# Altium project STM32F103ZET6_HARDWARE.PrjPcb
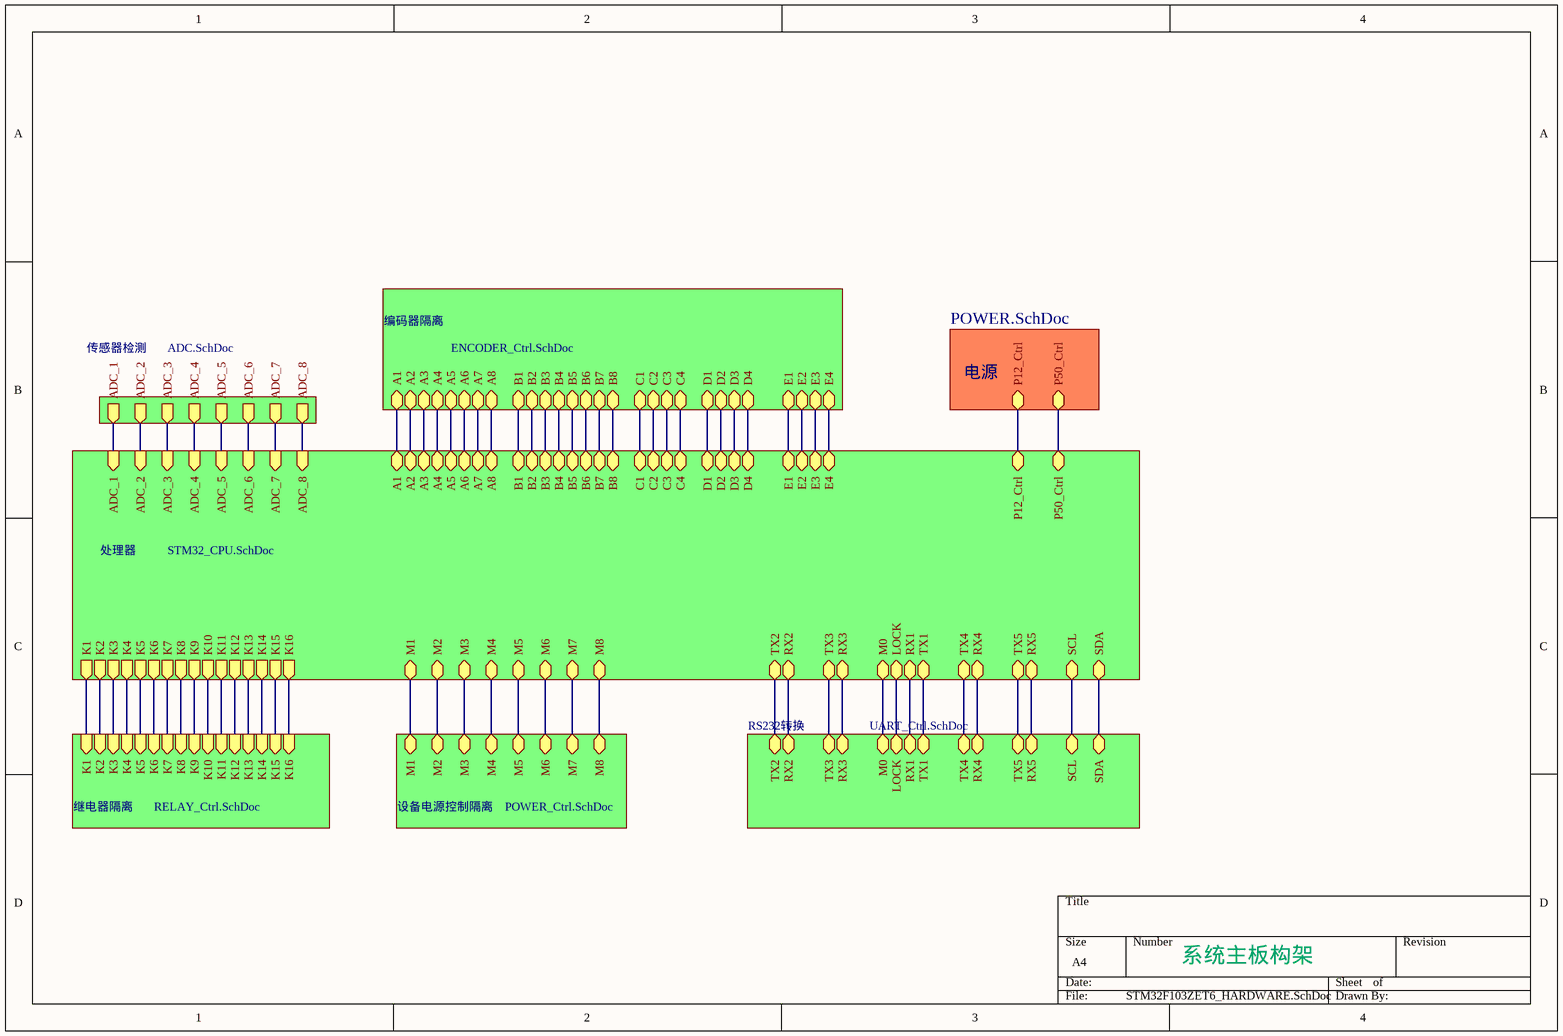
[diagram p0: STM32F103ZET6_HARDWARE.SchDoc]
8 sheets, 325 parts. Net scope: hierarchical (ports join the sheet entries above them; power ports are global).
Board file: STM32F103ZET6_HARDWARE.PcbDoc
Sheets:
  STM32F103ZET6_HARDWARE.SchDoc
    电源 = POWER.SchDoc
    处理器 = STM32_CPU.SchDoc
    编码器隔离 = ENCODER_Ctrl.SchDoc
    继电器隔离 = RELAY_Ctrl.SchDoc
    RS232转换 = UART_Ctrl.SchDoc
    设备电源控制隔离 = POWER_Ctrl.SchDoc
    传感器检测 = ADC.SchDoc

## Sheet STM32F103ZET6_HARDWARE.SchDoc: The robot embedded motherboar
size A4; CompanyName: 中煤科工集团重庆研究院; DrawnBy: leiyitan; Engineer: leiyitan@qq.com; Revision: V3.0; SheetNumber: 1; DocumentName: STM32F103ZET6_HARDWARE.SchDoc

### Sub-sheets
RS232转换 = UART_Ctrl.SchDoc: TX2, RX2, TX3, RX3, RX1, TX1, RX4 (bidir), TX4 (bidir), TX5 (bidir), RX5 (bidir), SCL (bidir), SDA (bidir), LOCK, M0
传感器检测 = ADC.SchDoc: ADC_1 (out), ADC_2 (out), ADC_3 (out), ADC_4 (out), ADC_5 (out), ADC_6 (out), ADC_7 (out), ADC_8 (out)
处理器 = STM32_CPU.SchDoc: TX1, RX1, TX2, RX2, TX3, RX3, TX4 (bidir), RX4 (bidir), M1 (bidir), M2 (bidir), M3 (bidir), M4 (bidir), M5 (bidir), M6 (bidir), M7 (bidir), M8 (bidir), K1 (out), K2 (out), K3 (out), K4 (out), K5 (out), K6 (out), A2, A4, A3, ADC_1 (in), ADC_2 (in), ADC_3 (in), ADC_4 (in), ADC_5 (in), ADC_6 (in), ADC_7 (in), ADC_8 (in), K7 (out), K8 (out), TX5 (bidir), RX5 (bidir), A1, A6, A8, A7, A5, B2 (bidir), B4 (bidir), B3 (bidir), B1 (bidir), B6 (bidir), B8 (bidir), B7 (bidir), B5 (bidir), C2 (bidir), C4 (bidir), C3 (bidir), C1 (bidir), D2 (bidir), D4 (bidir), D3 (bidir), D1 (bidir), K9 (out), K10 (out), K11 (out), K12 (out), K13 (out), K14 (out), K15 (out), K16 (out), SCL (bidir), SDA (bidir), E2 (bidir), E4 (bidir), E3 (bidir), E1 (bidir), P50_Ctrl (bidir), P12_Ctrl (bidir), LOCK, M0
电源 = POWER.SchDoc: P50_Ctrl (bidir), P12_Ctrl (bidir)
继电器隔离 = RELAY_Ctrl.SchDoc: K1 (in), K2 (in), K3 (in), K4 (in), K5 (in), K6 (in), K7 (in), K8 (in), K9 (in), K10 (in), K11 (in), K12 (in), K13 (in), K14 (in), K15 (in), K16 (in)
编码器隔离 = ENCODER_Ctrl.SchDoc: A2, A4, A3, A1, A6, A8, A7, A5, B2 (bidir), B4 (bidir), B3 (bidir), B1 (bidir), B6 (bidir), B8 (bidir), B7 (bidir), B5 (bidir), C2 (bidir), C4 (bidir), C3 (bidir), C1 (bidir), D2 (bidir), D4 (bidir), D3 (bidir), D1 (bidir), E2 (bidir), E4 (bidir), E3 (bidir), E1 (bidir)
设备电源控制隔离 = POWER_Ctrl.SchDoc: M1 (bidir), M2 (bidir), M3 (bidir), M4 (bidir), M5 (bidir), M6 (bidir), M7 (bidir), M8 (bidir)

### Nets
LOCK: sheet 处理器/LOCK, sheet RS232转换/LOCK
M0: sheet 处理器/M0, sheet RS232转换/M0
NetP2_3: sheet 处理器/ADC_4, sheet 传感器检测/ADC_4
NetP2_4: sheet 处理器/ADC_3, sheet 传感器检测/ADC_3
NetP2_5: sheet 处理器/ADC_2, sheet 传感器检测/ADC_2
NetP2_6: sheet 处理器/ADC_1, sheet 传感器检测/ADC_1
NetP25_3: sheet 处理器/TX1, sheet RS232转换/TX1
NetP25_4: sheet 处理器/RX1, sheet RS232转换/RX1
NetR2_3: sheet 处理器/ADC_8, sheet 传感器检测/ADC_8
NetR4_3: sheet 处理器/ADC_7, sheet 传感器检测/ADC_7
NetR6_3: sheet 处理器/ADC_6, sheet 传感器检测/ADC_6
NetR8_3: sheet 处理器/ADC_5, sheet 传感器检测/ADC_5
NetR14_1: sheet 处理器/C1, sheet 编码器隔离/C1
NetR17_1: sheet 处理器/C2, sheet 编码器隔离/C2
NetR18_1: sheet 处理器/A8, sheet 编码器隔离/A8
NetR19_1: sheet 处理器/C3, sheet 编码器隔离/C3
NetR22_1: sheet 处理器/A7, sheet 编码器隔离/A7
NetR23_1: sheet 处理器/C4, sheet 编码器隔离/C4
NetR24_1: sheet 处理器/A6, sheet 编码器隔离/A6
NetR27_1: sheet 处理器/A5, sheet 编码器隔离/A5
NetR30_1: sheet 处理器/A4, sheet 编码器隔离/A4
NetR33_1: sheet 处理器/D1, sheet 编码器隔离/D1
NetR34_1: sheet 处理器/A3, sheet 编码器隔离/A3
NetR35_1: sheet 处理器/A2, sheet 编码器隔离/A2
NetR37_1: sheet 处理器/D2, sheet 编码器隔离/D2
NetR39_1: sheet 处理器/D3, sheet 编码器隔离/D3
NetR40_1: sheet 处理器/A1, sheet 编码器隔离/A1
NetR43_1: sheet 处理器/D4, sheet 编码器隔离/D4
NetR47_1: sheet 处理器/B1, sheet 编码器隔离/B1
NetR48_1: sheet 处理器/E1, sheet 编码器隔离/E1
NetR50_1: sheet 处理器/B2, sheet 编码器隔离/B2
NetR52_1: sheet 处理器/E2, sheet 编码器隔离/E2
NetR53_1: sheet 处理器/B3, sheet 编码器隔离/B3
NetR55_1: sheet 处理器/E3, sheet 编码器隔离/E3
NetR57_1: sheet 处理器/B4, sheet 编码器隔离/B4
NetR58_1: sheet 处理器/E4, sheet 编码器隔离/E4
NetR62_1: sheet 处理器/B5, sheet 编码器隔离/B5
NetR64_1: sheet 处理器/B6, sheet 编码器隔离/B6
NetR65_1: sheet 处理器/B7, sheet 编码器隔离/B7
NetR67_1: sheet 处理器/B8, sheet 编码器隔离/B8
NetR118_2: sheet 处理器/SDA, sheet RS232转换/SDA
NetR119_2: sheet 处理器/SCL, sheet RS232转换/SCL
NetU13_1: sheet 电源/P12_Ctrl, sheet 处理器/P12_Ctrl
NetU13_3: sheet 电源/P50_Ctrl, sheet 处理器/P50_Ctrl
NetU14_2: sheet 处理器/M1, sheet 设备电源控制隔离/M1
NetU14_3: sheet 处理器/M2, sheet 设备电源控制隔离/M2
NetU14_4: sheet 处理器/M3, sheet 设备电源控制隔离/M3
NetU14_5: sheet 处理器/M4, sheet 设备电源控制隔离/M4
NetU14_6: sheet 处理器/M5, sheet 设备电源控制隔离/M5
NetU14_7: sheet 处理器/M6, sheet 设备电源控制隔离/M6
NetU14_8: sheet 处理器/M7, sheet 设备电源控制隔离/M7
NetU14_9: sheet 处理器/M8, sheet 设备电源控制隔离/M8
NetU16_36: sheet 处理器/TX2, sheet RS232转换/TX2
NetU16_37: sheet 处理器/RX2, sheet RS232转换/RX2
NetU16_49: sheet 处理器/K16, sheet 继电器隔离/K16
NetU16_50: sheet 处理器/K15, sheet 继电器隔离/K15
NetU16_53: sheet 处理器/K14, sheet 继电器隔离/K14
NetU16_54: sheet 处理器/K13, sheet 继电器隔离/K13
NetU16_55: sheet 处理器/K12, sheet 继电器隔离/K12
NetU16_56: sheet 处理器/K11, sheet 继电器隔离/K11
NetU16_57: sheet 处理器/K10, sheet 继电器隔离/K10
NetU16_58: sheet 处理器/K9, sheet 继电器隔离/K9
NetU16_59: sheet 处理器/K8, sheet 继电器隔离/K8
NetU16_60: sheet 处理器/K7, sheet 继电器隔离/K7
NetU16_63: sheet 处理器/K6, sheet 继电器隔离/K6
NetU16_64: sheet 处理器/K5, sheet 继电器隔离/K5
NetU16_65: sheet 处理器/K4, sheet 继电器隔离/K4
NetU16_66: sheet 处理器/K3, sheet 继电器隔离/K3
NetU16_67: sheet 处理器/K2, sheet 继电器隔离/K2
NetU16_68: sheet 处理器/K1, sheet 继电器隔离/K1
NetU16_69: sheet 处理器/TX3, sheet RS232转换/TX3
NetU16_70: sheet 处理器/RX3, sheet RS232转换/RX3
NetU16_111: sheet 处理器/TX4, sheet RS232转换/TX4
NetU16_112: sheet 处理器/RX4, sheet RS232转换/RX4
NetU16_113: sheet 处理器/TX5, sheet RS232转换/TX5
NetU16_116: sheet 处理器/RX5, sheet RS232转换/RX5

### Notes on the sheet
- 系统主板构架

## Sheet POWER.SchDoc
size A4
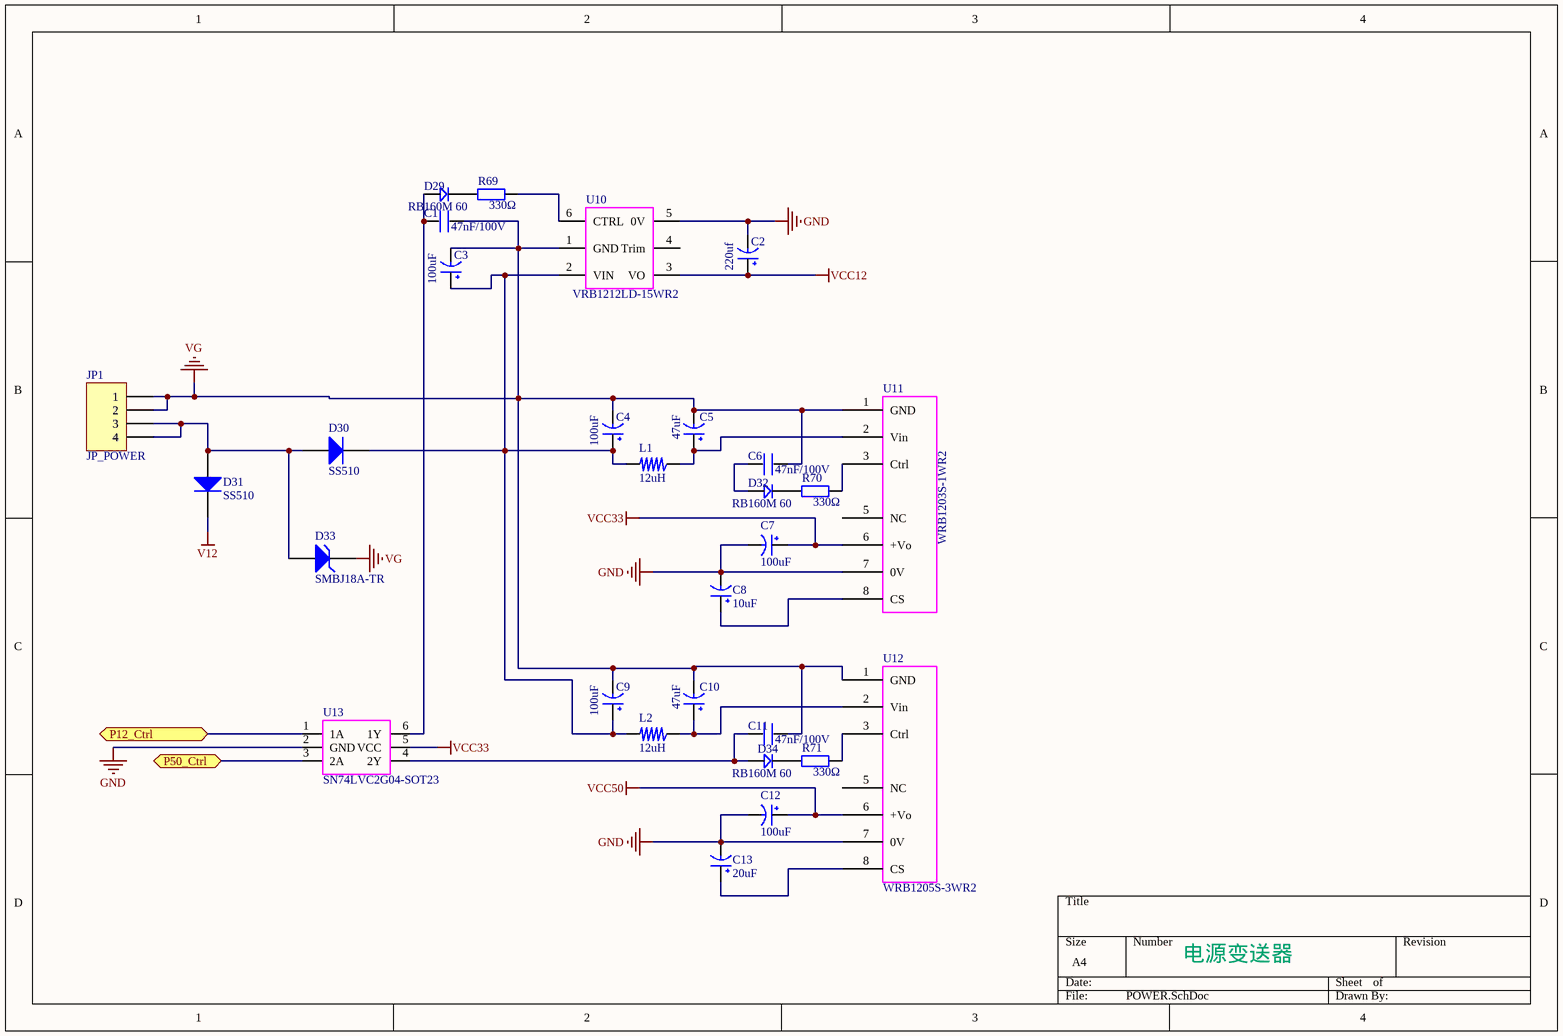
[diagram p1: POWER.SchDoc]

### Parts
C1  47nF/100V  [0603P]
C2  220uf  [SMD-EC-F6.3]
C3  100uF  [SMD-EC-F6.3]
C4  100uF  [SMD-EC-F6.3]
C5  47uF  [SMD-EC-F6.3]
C6  47nF/100V  [0603P]
C7  100uF  [SMD-EC-F6.3]
C8  10uF  [SMD-EC-F4]
C9  100uF  [SMD-EC-F6.3]
C10  47uF  [SMD-EC-F6.3]
C11  47nF/100V  [0603P]
C12  100uF  [SMD-EC-F6.3]
C13  20uF  [SMD-EC-F4]
D29  RB160M 60  [SOD123/X.85]
D30  SS510  [SMC]
D31  SS510  [SMC]
D32  RB160M 60  [SOD123/X.85]
D33  SMBJ18A-TR  [DO-214]
D34  RB160M 60  [SOD123/X.85]
JP1  JP_POWER  [3.81-4P]
L1  12uH  [4R7_L_7_7_4]
L2  12uH  [4R7_L_7_7_4]
R69  value 330Ω  [1206]  (hidden comment: Res2)
R70  value 330Ω  [1206]  (hidden comment: Res2)
R71  value 330Ω  [1206]  (hidden comment: Res2)
U10  VRB1212LD-15WR2  [VRB1212LD-15WR2]
U11  WRB1203S-1WR2  [WRB120XS-XWR2]
U12  WRB1205S-3WR2  [WRB120XS-XWR2]
U13  SN74LVC2G04-SOT23  [SOT23-6]

### Ports
P12_Ctrl, P50_Ctrl

### Nets
GND: C2.2(GND) C7.2(GND) C8.2(GND) C12.2(GND) C13.2(GND) U10.5(0V) U11.7(0V) U12.7(0V) U13.2(GND)
V12: D31.2(K)
VCC12: C2.1(VCC) U10.3(VO)
VCC33: C7.1(VCC) U11.6(+Vo) U13.5(VCC)
VCC50: C12.1(VCC) U12.6(+Vo)
VG: C1.2 C3.2(GND) C4.2(GND) C5.2(GND) C6.2 C9.2(GND) C10.2(GND) C11.2 D33.2(K) JP1.1 JP1.2 U10.1(GND) U11.1(GND) U12.1(GND)
NetC1_1: C1.1 D29.1 U13.6(1Y)
NetC3_1: C3.1(VCC) C4.1(VCC) C9.1(VCC) D30.2(K) L1.2 L2.2 U10.2(VIN)
NetC5_1: C5.1(VCC) L1.1 U11.2(Vin)
NetC6_1: C6.1 D32.1
NetC8_1: C8.1(VCC) U11.8(CS)
NetC10_1: C10.1(VCC) L2.1 U12.2(Vin)
NetC11_1: C11.1 D34.1 U13.4(2Y)
NetC13_1: C13.1(VCC) U12.8(CS)
NetD29_2: D29.2 R69.2
NetD30_1: D30.1(A) D31.1(A) D33.1(A) JP1.3 JP1.4
NetD32_2: D32.2 R70.2
NetD34_2: D34.2 R71.2
NetR69_1: R69.1 U10.6(CTRL)
NetR70_1: R70.1 U11.3(Ctrl)
NetR71_1: R71.1 U12.3(Ctrl)
NetU13_1: U13.1(1A) ; port P12_Ctrl
NetU13_3: U13.3(2A) ; port P50_Ctrl

Not connected (* = marked no-connect by the designer): U10 4(Trim); U11 5(NC); U12 5(NC)

### Notes on the sheet
- 电源变送器

### Library data of the parts
C1 C6 C11 = C
C2-C5 C7-C10 C12 C13 = CAP
D29 D32 D34 = D
D30 D31 = Diode: Default Diode; Published: 8-Jun-2000; LatestRevisionDate: 17-Jul-2002; LatestRevisionNote: Re-released for DXP Platform.; PackageVersion: Sep-1996; PackageReference: SMC; Publisher: Altium Limited; Code_JEDEC: DO-214-AB
D33 = D Zener: Zener Diode; Published: 8-Jun-2000; LatestRevisionDate: 17-Jul-2002; LatestRevisionNote: Re-released for DXP Platform.; PackageReference: DIODE-0.7; Publisher: Altium Limited
JP1 = Header 4: Header, 4-Pin; LatestRevisionDate: 17-Jul-2002; LatestRevisionNote: Re-released for DXP Platform.; Publisher: Altium Limited
L1 L2 = L_SOP
R69-R71 = Res2: Resistor; Published: 8-Jun-2000; LatestRevisionDate: 17-Jul-2002; LatestRevisionNote: Re-released for DXP Platform.; PackageReference: AXIAL-0.4; Publisher: Altium Limited

## Sheet STM32_CPU.SchDoc
size A3
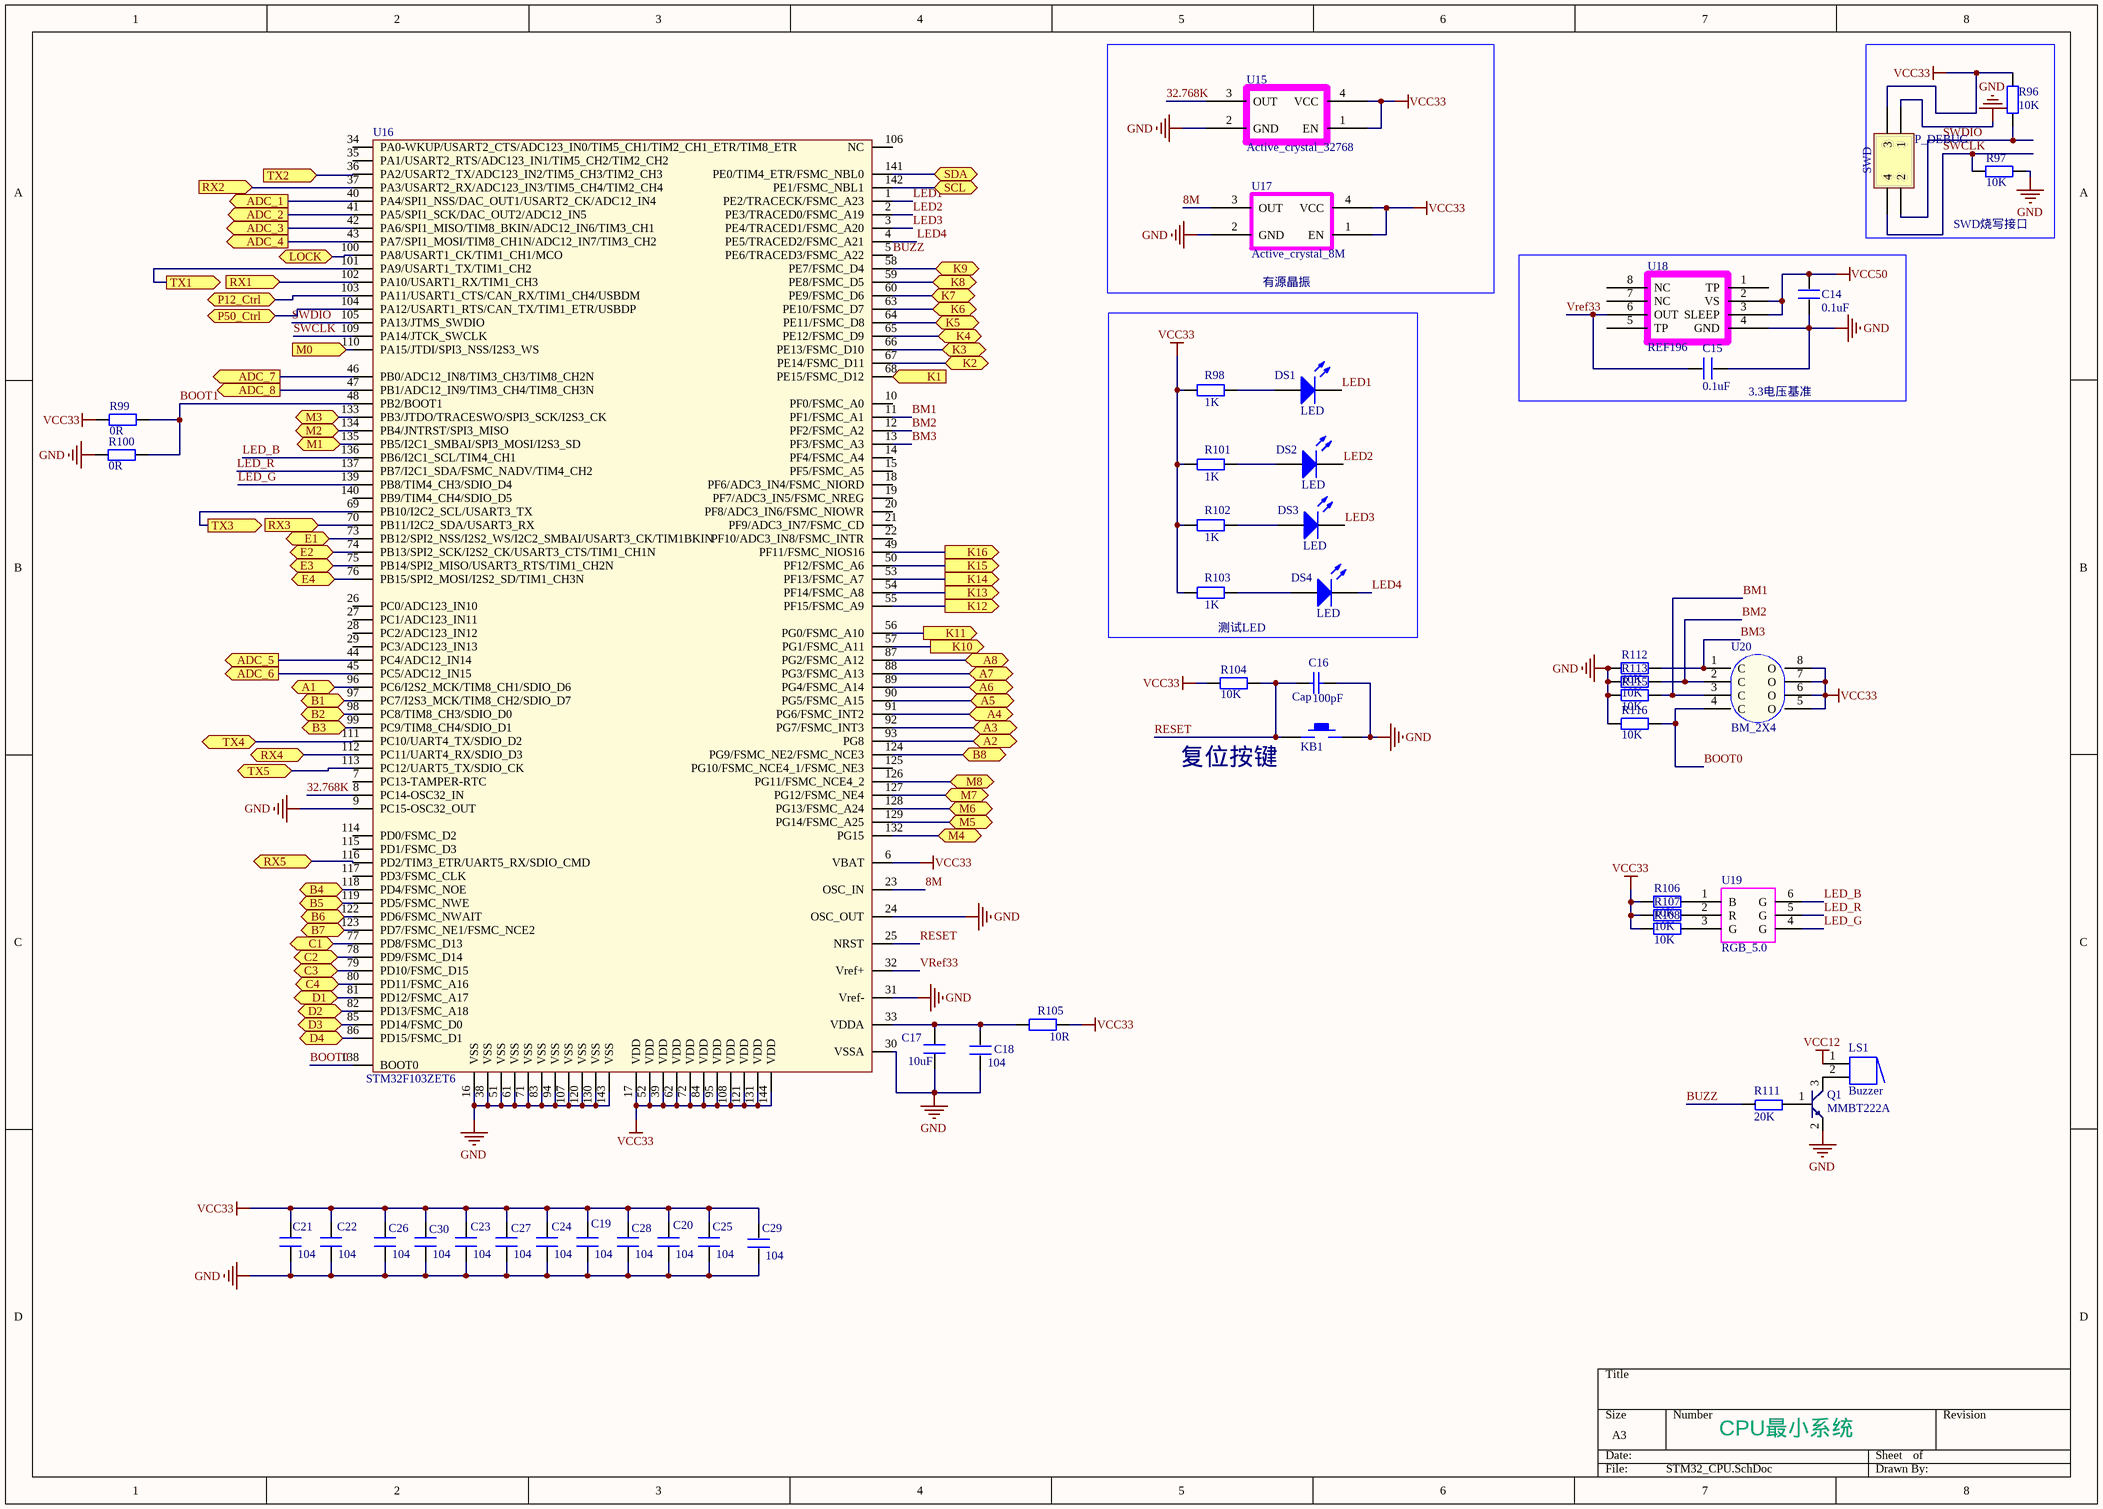
[diagram p2: STM32_CPU.SchDoc]

### Parts
C14  0.1uF  [CAPC1608L]
C15  0.1uF  [CAPC1608L]
C16  Cap  value 100pF  [1206C]
C17  10uF  [1206]
C18  104  [1206]
C19  104  [1206]
C20  104  [1206]
C21  104  [1206]
C22  104  [1206]
C23  104  [1206]
C24  104  [1206]
C25  104  [1206]
C26  104  [1206]
C27  104  [1206]
C28  104  [1206]
C29  104  [1206]
C30  104  [1206]
DS1  LED  [LED-1206]
DS2  LED  [LED-1206]
DS3  LED  [LED-1206]
DS4  LED  [LED-1206]
KB1  KEY_M  [HDR1X2]  (value not drawn)
LS1  Buzzer  [BELL]
P_DEBUG  SWD  [HDR2X2]
Q1  MMBT222A  [SOT-23]
R96  value 10K  [1206]  (hidden comment: Res2)
R97  value 10K  [1206]  (hidden comment: Res2)
R98  value 1K  [1206R]  (hidden comment: Res2)
R99  value 0R  [1206R]  (hidden comment: Res2)
R100  value 0R  [1206R]  (hidden comment: Res2)
R101  value 1K  [1206R]  (hidden comment: Res2)
R102  value 1K  [1206R]  (hidden comment: Res2)
R103  value 1K  [1206R]  (hidden comment: Res2)
R104  value 10K  [1206R]  (hidden comment: Res2)
R105  value 10R  [1206]  (hidden comment: Res2)
R106  value 10K  [1206]  (hidden comment: Res2)
R107  value 10K  [1206]  (hidden comment: Res2)
R108  value 10K  [1206]  (hidden comment: Res2)
R111  20K  [1206R]
R112  value 10K  [1206]  (hidden comment: Res2)
R113  value 10K  [1206]  (hidden comment: Res2)
R115  value 10K  [1206]  (hidden comment: Res2)
R116  value 10K  [1206]  (hidden comment: Res2)
U15  Active_crystal_32768  [Active_crystal_3225]
U16  STM32F103ZET6  [LQFP144]
U17  Active_crystal_8M  [Active_crystal_3225]
U18  REF196  [SOP8N]
U19  RGB_5.0  [RGB_5.0]
U20  BM_2X4  [BM_2X4]

### Blocks framed on the sheet
有源晶振: U15 U17
SWD烧写接口: P_DEBUG R96 R97
3.3电压基准: C14 C15 U18
测试LED: DS1-DS4 R98 R101-R103

### Ports
A1, A2, A3, A4, A5, A6, A7, A8, ADC_1 (out), ADC_2 (out), ADC_3 (out), ADC_4 (out), ADC_5 (out), ADC_6 (out), ADC_7 (out), ADC_8 (out), B1, B2, B3, B4, B5, B6, B7, B8, C1, C2, C3, C4, D1, D2, D3, D4, E1, E2, E3, E4, K1 (out), K2, K3, K4, K5, K6, K7, K8, K9, K10 (out), K11 (out), K12 (out), K13 (out), K14 (out), K15 (out), K16 (out), LOCK, M0 (in), M1, M2, M3, M4, M5, M6, M7, M8, P12_Ctrl, P50_Ctrl, RX1 (in), RX2, RX3 (in), RX4 (bidir), RX5, SCL (bidir), SDA (bidir), TX1 (out), TX2, TX3 (out), TX4 (bidir), TX5

### Nets
GND: C14.1 C15.2 C16.1 C17.2 C18.2 C19.2 C20.2 C21.2 C22.2 C23.2 C24.2 C25.2 C26.2 C27.2 C28.2 C29.2 C30.2 KB1.2 P_DEBUG.1 Q1.2(E) R97.2 R100.2 R112.1 R113.1 R115.1 R116.1 U15.2(GND) U16.9(PC15-OSC32_OUT) U16.16(VSS) U16.24(OSC_OUT) U16.30(VSSA) U16.31(Vref-) U16.38(VSS) U16.51(VSS) U16.61(VSS) U16.71(VSS) U16.83(VSS) U16.94(VSS) U16.107(VSS) U16.120(VSS) U16.130(VSS) U16.143(VSS) U17.2(GND) U18.4(GND)
VCC12: LS1.1
VCC33: C19.1 C20.1 C21.1 C22.1 C23.1 C24.1 C25.1 C26.1 C27.1 C28.1 C29.1 C30.1 P_DEBUG.3 R96.2 R98.1 R99.2 R101.1 R102.1 R103.1 R104.2 R105.1 R106.2 R107.2 R108.2 U15.1(EN) U15.4(VCC) U16.6(VBAT) U16.17(VDD) U16.39(VDD) U16.52(VDD) U16.62(VDD) U16.72(VDD) U16.84(VDD) U16.95(VDD) U16.108(VDD) U16.121(VDD) U16.131(VDD) U16.144(VDD) U17.1(EN) U17.4(VCC) U20.5(O) U20.6(O) U20.7(O) U20.8(O)
VCC50: C14.2 U18.2(VS) U18.3(SLEEP)
8M: U16.23(OSC_IN) U17.3(OUT)
32.768K: U15.3(OUT) U16.8(PC14-OSC32_IN)
BM1: R115.2 U16.11(PF1/FSMC_A1) U20.3(C)
BM2: R113.2 U16.12(PF2/FSMC_A2) U20.2(C)
BM3: R112.2 U16.13(PF3/FSMC_A3) U20.1(C)
BOOT0: R116.2 U16.138(BOOT0) U20.4(C)
BOOT1: R99.1 R100.1 U16.48(PB2/BOOT1)
BUZZ: R111.1 U16.5(PE6/TRACED3/FSMC_A22)
LED1: DS1.2(K) U16.1(PE2/TRACECK/FSMC_A23)
LED2: DS2.2(K) U16.2(PE3/TRACED0/FSMC_A19)
LED3: DS3.2(K) U16.3(PE4/TRACED1/FSMC_A20)
LED4: DS4.2(K) U16.4(PE5/TRACED2/FSMC_A21)
LED_B: U16.136(PB6/I2C1_SCL/TIM4_CH1) U19.6(G)
LED_G: U16.139(PB8/TIM4_CH3/SDIO_D4) U19.4(G)
LED_R: U16.137(PB7/I2C1_SDA/FSMC_NADV/TIM4_CH2) U19.5(G)
LOCK: U16.100(PA8/USART1_CK/TIM1_CH1/MCO) ; port LOCK
M0: U16.110(PA15/JTDI/SPI3_NSS/I2S3_WS) ; port M0
RESET: C16.2 KB1.1 R104.1 U16.25(NRST)
SWCLK: P_DEBUG.4 R97.1 U16.109(PA14/JTCK_SWCLK)
SWDIO: P_DEBUG.2 R96.1 U16.105(PA13/JTMS_SWDIO)
Vref33: C15.1 U16.32(Vref+) U18.6(OUT)
NetC17_1: C17.1 C18.1 R105.2 U16.33(VDDA)
NetDS1_1: DS1.1(A) R98.2
NetDS2_1: DS2.1(A) R101.2
NetDS3_1: DS3.1(A) R102.2
NetDS4_1: DS4.1(A) R103.2
NetLS1_2: LS1.2 Q1.3(C)
NetP2_3: U16.43(PA7/SPI1_MOSI/TIM8_CH1N/ADC12_IN7/TIM3_CH2) ; port ADC_4
NetP2_4: U16.42(PA6/SPI1_MISO/TIM8_BKIN/ADC12_IN6/TIM3_CH1) ; port ADC_3
NetP2_5: U16.41(PA5/SPI1_SCK/DAC_OUT2/ADC12_IN5) ; port ADC_2
NetP2_6: U16.40(PA4/SPI1_NSS/DAC_OUT1/USART2_CK/ADC12_IN4) ; port ADC_1
NetP25_3: U16.101(PA9/USART1_TX/TIM1_CH2) ; port TX1
NetP25_4: U16.102(PA10/USART1_RX/TIM1_CH3) ; port RX1
NetQ1_1: Q1.1(B) R111.2
NetR2_3: U16.47(PB1/ADC12_IN9/TIM3_CH4/TIM8_CH3N) ; port ADC_8
NetR4_3: U16.46(PB0/ADC12_IN8/TIM3_CH3/TIM8_CH2N) ; port ADC_7
NetR6_3: U16.45(PC5/ADC12_IN15) ; port ADC_6
NetR8_3: U16.44(PC4/ADC12_IN14) ; port ADC_5
NetR14_1: U16.77(PD8/FSMC_D13) ; port C1
NetR17_1: U16.78(PD9/FSMC_D14) ; port C2
NetR18_1: U16.87(PG2/FSMC_A12) ; port A8
NetR19_1: U16.79(PD10/FSMC_D15) ; port C3
NetR22_1: U16.88(PG3/FSMC_A13) ; port A7
NetR23_1: U16.80(PD11/FSMC_A16) ; port C4
NetR24_1: U16.89(PG4/FSMC_A14) ; port A6
NetR27_1: U16.90(PG5/FSMC_A15) ; port A5
NetR30_1: U16.91(PG6/FSMC_INT2) ; port A4
NetR33_1: U16.81(PD12/FSMC_A17) ; port D1
NetR34_1: U16.92(PG7/FSMC_INT3) ; port A3
NetR35_1: U16.93(PG8) ; port A2
NetR37_1: U16.82(PD13/FSMC_A18) ; port D2
NetR39_1: U16.85(PD14/FSMC_D0) ; port D3
NetR40_1: U16.96(PC6/I2S2_MCK/TIM8_CH1/SDIO_D6) ; port A1
NetR43_1: U16.86(PD15/FSMC_D1) ; port D4
NetR47_1: U16.97(PC7/I2S3_MCK/TIM8_CH2/SDIO_D7) ; port B1
NetR48_1: U16.73(PB12/SPI2_NSS/I2S2_WS/I2C2_SMBAI/USART3_CK/TIM1BKIN) ; port E1
NetR50_1: U16.98(PC8/TIM8_CH3/SDIO_D0) ; port B2
NetR52_1: U16.74(PB13/SPI2_SCK/I2S2_CK/USART3_CTS/TIM1_CH1N) ; port E2
NetR53_1: U16.99(PC9/TIM8_CH4/SDIO_D1) ; port B3
NetR55_1: U16.75(PB14/SPI2_MISO/USART3_RTS/TIM1_CH2N) ; port E3
NetR57_1: U16.118(PD4/FSMC_NOE) ; port B4
NetR58_1: U16.76(PB15/SPI2_MOSI/I2S2_SD/TIM1_CH3N) ; port E4
NetR62_1: U16.119(PD5/FSMC_NWE) ; port B5
NetR64_1: U16.122(PD6/FSMC_NWAIT) ; port B6
NetR65_1: U16.123(PD7/FSMC_NE1/FSMC_NCE2) ; port B7
NetR67_1: U16.124(PG9/FSMC_NE2/FSMC_NCE3) ; port B8
NetR106_1: R106.1 U19.1(B)
NetR107_1: R107.1 U19.2(R)
NetR108_1: R108.1 U19.3(G)
NetR118_2: U16.141(PE0/TIM4_ETR/FSMC_NBL0) ; port SDA
NetR119_2: U16.142(PE1/FSMC_NBL1) ; port SCL
NetU13_1: U16.103(PA11/USART1_CTS/CAN_RX/TIM1_CH4/USBDM) ; port P12_Ctrl
NetU13_3: U16.104(PA12/USART1_RTS/CAN_TX/TIM1_ETR/USBDP) ; port P50_Ctrl
NetU14_2: U16.135(PB5/I2C1_SMBAI/SPI3_MOSI/I2S3_SD) ; port M1
NetU14_3: U16.134(PB4/JNTRST/SPI3_MISO) ; port M2
NetU14_4: U16.133(PB3/JTDO/TRACESWO/SPI3_SCK/I2S3_CK) ; port M3
NetU14_5: U16.132(PG15) ; port M4
NetU14_6: U16.129(PG14/FSMC_A25) ; port M5
NetU14_7: U16.128(PG13/FSMC_A24) ; port M6
NetU14_8: U16.127(PG12/FSMC_NE4) ; port M7
NetU14_9: U16.126(PG11/FSMC_NCE4_2) ; port M8
NetU16_36: U16.36(PA2/USART2_TX/ADC123_IN2/TIM5_CH3/TIM2_CH3) ; port TX2
NetU16_37: U16.37(PA3/USART2_RX/ADC123_IN3/TIM5_CH4/TIM2_CH4) ; port RX2
NetU16_49: U16.49(PF11/FSMC_NIOS16) ; port K16
NetU16_50: U16.50(PF12/FSMC_A6) ; port K15
NetU16_53: U16.53(PF13/FSMC_A7) ; port K14
NetU16_54: U16.54(PF14/FSMC_A8) ; port K13
NetU16_55: U16.55(PF15/FSMC_A9) ; port K12
NetU16_56: U16.56(PG0/FSMC_A10) ; port K11
NetU16_57: U16.57(PG1/FSMC_A11) ; port K10
NetU16_58: U16.58(PE7/FSMC_D4) ; port K9
NetU16_59: U16.59(PE8/FSMC_D5) ; port K8
NetU16_60: U16.60(PE9/FSMC_D6) ; port K7
NetU16_63: U16.63(PE10/FSMC_D7) ; port K6
NetU16_64: U16.64(PE11/FSMC_D8) ; port K5
NetU16_65: U16.65(PE12/FSMC_D9) ; port K4
NetU16_66: U16.66(PE13/FSMC_D10) ; port K3
NetU16_67: U16.67(PE14/FSMC_D11) ; port K2
NetU16_68: U16.68(PE15/FSMC_D12) ; port K1
NetU16_69: U16.69(PB10/I2C2_SCL/USART3_TX) ; port TX3
NetU16_70: U16.70(PB11/I2C2_SDA/USART3_RX) ; port RX3
NetU16_111: U16.111(PC10/UART4_TX/SDIO_D2) ; port TX4
NetU16_112: U16.112(PC11/UART4_RX/SDIO_D3) ; port RX4
NetU16_113: U16.113(PC12/UART5_TX/SDIO_CK) ; port TX5
NetU16_116: U16.116(PD2/TIM3_ETR/UART5_RX/SDIO_CMD) ; port RX5

Not connected (* = marked no-connect by the designer): U16 7(PC13-TAMPER-RTC) 10(PF0/FSMC_A0) 14(PF4/FSMC_A4) 15(PF5/FSMC_A5) 18(PF6/ADC3_IN4/FSMC_NIORD) 19(PF7/ADC3_IN5/FSMC_NREG) 20(PF8/ADC3_IN6/FSMC_NIOWR) 21(PF9/ADC3_IN7/FSMC_CD) 22(PF10/ADC3_IN8/FSMC_INTR) 26(PC0/ADC123_IN10) 27(PC1/ADC123_IN11) 28(PC2/ADC123_IN12) 29(PC3/ADC123_IN13) 34(PA0-WKUP/USART2_CTS/ADC123_IN0/TIM5_CH1/TIM2_CH1_ETR/TIM8_ETR) 35(PA1/USART2_RTS/ADC123_IN1/TIM5_CH2/TIM2_CH2) 106(NC) 114(PD0/FSMC_D2) 115(PD1/FSMC_D3) 117(PD3/FSMC_CLK) 125(PG10/FSMC_NCE4_1/FSMC_NE3) 140(PB9/TIM4_CH4/SDIO_D5); U18 1(TP) 5(TP) 7(NC) 8(NC)

### Notes on the sheet
- 复位按键
- CPU最小系统

### Library data of the parts
C14 C15 C17-C30 = C
C16 = Cap: Capacitor; Published: 8-Jun-2000; LatestRevisionDate: 17-Jul-2002; LatestRevisionNote: Re-released for DXP Platform.; PackageReference: RAD-0.3; Publisher: Altium Limited
DS1-DS4 = LED2: Typical RED, GREEN, YELLOW, AMBER GaAs LED; Published: 8-Jun-2000; LatestRevisionDate: 17-Jul-2002; LatestRevisionNote: Re-released for DXP Platform.; PackageDocument: Feb-2002; PackageReference: 3.2X1.6X1.1; Publisher: Altium Limited
LS1 = Buzzer: Magnetic Transducer Buzzer; Published: 24-Mar-1999; LatestRevisionDate: 17-Dec-2003; LatestRevisionNote: Schematic revised, PCB Footprint replaced.; DatasheetVersion: 17-Dec-2003; PackageReference: ABSM-1574; Publisher: Altium Limited; ComponentLink1Description: Manufacturer Link; ComponentLink1URL: http://www.megastar.com/linecard/buzzmode/index.php
P_DEBUG = Header 2X2: Header, 2-Pin, Dual row; LatestRevisionDate: 17-Jul-2002; LatestRevisionNote: Re-released for DXP Platform.; Publisher: Altium Limited
Q1 = NPN: 8050/BCW846/BCW847
R96-R108 R112 R113 R115 R116 = Res2: Resistor; Published: 8-Jun-2000; LatestRevisionDate: 17-Jul-2002; LatestRevisionNote: Re-released for DXP Platform.; PackageReference: AXIAL-0.4; Publisher: Altium Limited
R111 = R

## Sheet ENCODER_Ctrl.SchDoc
size A4
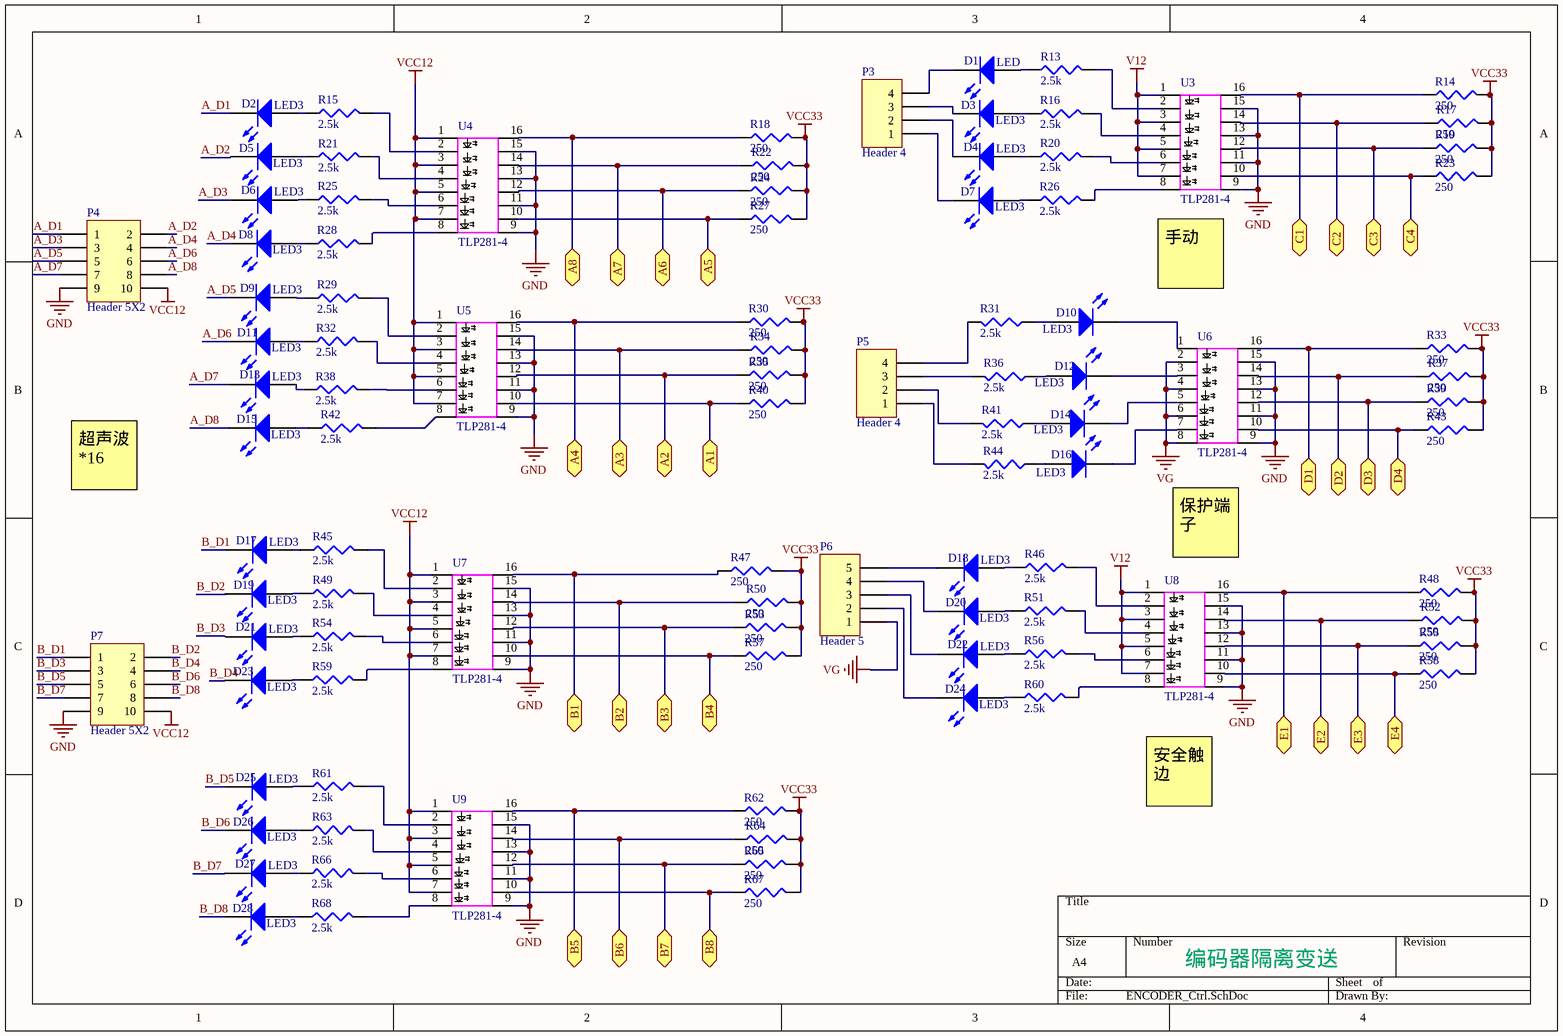
[diagram p3: ENCODER_Ctrl.SchDoc]

### Parts
D1  LED  [LED-1206]
D2  LED3  [LED-1206]
D3  LED3  [LED-1206]
D4  LED3  [LED-1206]
D5  LED3  [LED-1206]
D6  LED3  [LED-1206]
D7  LED3  [LED-1206]
D8  LED3  [LED-1206]
D9  LED3  [LED-1206]
D10  LED3  [LED-1206]
D11  LED3  [LED-1206]
D12  LED3  [LED-1206]
D13  LED3  [LED-1206]
D14  LED3  [LED-1206]
D15  LED3  [LED-1206]
D16  LED3  [LED-1206]
D17  LED3  [LED-1206]
D18  LED3  [LED-1206]
D19  LED3  [LED-1206]
D20  LED3  [LED-1206]
D21  LED3  [LED-1206]
D22  LED3  [LED-1206]
D23  LED3  [LED-1206]
D24  LED3  [LED-1206]
D25  LED3  [LED-1206]
D26  LED3  [LED-1206]
D27  LED3  [LED-1206]
D28  LED3  [LED-1206]
P3  Header 4  [3.81-4P]
P4  Header 5X2  [HDR2X5]
P5  Header 4  [3.81-4P]
P6  Header 5  [3.81-5P]
P7  Header 5X2  [HDR2X5]
R13  value 2.5k  [1206R]  (hidden comment: Res3)
R14  value 250  [1206R]  (hidden comment: Res3)
R15  value 2.5k  [1206R]  (hidden comment: Res3)
R16  value 2.5k  [1206R]  (hidden comment: Res3)
R17  value 250  [1206R]  (hidden comment: Res3)
R18  value 250  [1206R]  (hidden comment: Res3)
R19  value 250  [1206R]  (hidden comment: Res3)
R20  value 2.5k  [1206R]  (hidden comment: Res3)
R21  value 2.5k  [1206R]  (hidden comment: Res3)
R22  value 250  [1206R]  (hidden comment: Res3)
R23  value 250  [1206R]  (hidden comment: Res3)
R24  value 250  [1206R]  (hidden comment: Res3)
R25  value 2.5k  [1206R]  (hidden comment: Res3)
R26  value 2.5k  [1206R]  (hidden comment: Res3)
R27  value 250  [1206R]  (hidden comment: Res3)
R28  value 2.5k  [1206R]  (hidden comment: Res3)
R29  value 2.5k  [1206R]  (hidden comment: Res3)
R30  value 250  [1206R]  (hidden comment: Res3)
R31  value 2.5k  [1206R]  (hidden comment: Res3)
R32  value 2.5k  [1206R]  (hidden comment: Res3)
R33  value 250  [1206R]  (hidden comment: Res3)
R34  value 250  [1206R]  (hidden comment: Res3)
R35  value 250  [1206R]  (hidden comment: Res3)
R36  value 2.5k  [1206R]  (hidden comment: Res3)
R37  value 250  [1206R]  (hidden comment: Res3)
R38  value 2.5k  [1206R]  (hidden comment: Res3)
R39  value 250  [1206R]  (hidden comment: Res3)
R40  value 250  [1206R]  (hidden comment: Res3)
R41  value 2.5k  [1206R]  (hidden comment: Res3)
R42  value 2.5k  [1206R]  (hidden comment: Res3)
R43  value 250  [1206R]  (hidden comment: Res3)
R44  value 2.5k  [1206R]  (hidden comment: Res3)
R45  value 2.5k  [1206R]  (hidden comment: Res3)
R46  value 2.5k  [1206R]  (hidden comment: Res3)
R47  value 250  [1206R]  (hidden comment: Res3)
R48  value 250  [1206R]  (hidden comment: Res3)
R49  value 2.5k  [1206R]  (hidden comment: Res3)
R50  value 250  [1206R]  (hidden comment: Res3)
R51  value 2.5k  [1206R]  (hidden comment: Res3)
R52  value 250  [1206R]  (hidden comment: Res3)
R53  value 250  [1206R]  (hidden comment: Res3)
R54  value 2.5k  [1206R]  (hidden comment: Res3)
R55  value 250  [1206R]  (hidden comment: Res3)
R56  value 2.5k  [1206R]  (hidden comment: Res3)
R57  value 250  [1206R]  (hidden comment: Res3)
R58  value 250  [1206R]  (hidden comment: Res3)
R59  value 2.5k  [1206R]  (hidden comment: Res3)
R60  value 2.5k  [1206R]  (hidden comment: Res3)
R61  value 2.5k  [1206R]  (hidden comment: Res3)
R62  value 250  [1206R]  (hidden comment: Res3)
R63  value 2.5k  [1206R]  (hidden comment: Res3)
R64  value 250  [1206R]  (hidden comment: Res3)
R65  value 250  [1206R]  (hidden comment: Res3)
R66  value 2.5k  [1206R]  (hidden comment: Res3)
R67  value 250  [1206R]  (hidden comment: Res3)
R68  value 2.5k  [1206R]  (hidden comment: Res3)
U3  TLP281-4  [SO16]
U4  TLP281-4  [SO16]
U5  TLP281-4  [SO16]
U6  TLP281-4  [SO16]
U7  TLP281-4  [SO16]
U8  TLP281-4  [SO16]
U9  TLP281-4  [SO16]

### Ports
A1, A2, A3, A4, A5, A6, A7, A8, B1, B2, B3, B4, B5, B6, B7, B8, C1, C2, C3, C4, D1, D2, D3, D4, E1, E2, E3, E4

### Nets
GND: P4.9 P7.9 U3.9 U3.11 U3.13 U3.15 U4.9 U4.11 U4.13 U4.15 U5.9 U5.11 U5.13 U5.15 U6.9 U6.11 U6.13 U6.15 U7.9 U7.11 U7.13 U7.15 U8.9 U8.11 U8.13 U8.15 U9.9 U9.11 U9.13 U9.15
V12: U3.1 U3.3 U3.5 U3.7 U8.1 U8.3 U8.5 U8.7
VCC12: P4.10 P7.10 U4.1 U4.3 U4.5 U4.7 U5.1 U5.3 U5.5 U5.7 U7.1 U7.3 U7.5 U7.7 U9.1 U9.3 U9.5 U9.7
VCC33: R14.2 R17.2 R18.2 R19.2 R22.2 R23.2 R24.2 R27.2 R30.2 R33.2 R34.2 R35.2 R37.2 R39.2 R40.2 R43.2 R47.2 R48.2 R50.2 R52.2 R53.2 R55.2 R57.2 R58.2 R62.2 R64.2 R65.2 R67.2
VG: P6.1 U6.2 U6.4 U6.6 U6.8
A_D1: D2.2(K) P4.1
A_D2: D5.2(K) P4.2
A_D3: D6.2(K) P4.3
A_D4: D8.2(K) P4.4
A_D5: D9.2(K) P4.5
A_D6: D11.2(K) P4.6
A_D7: D13.2(K) P4.7
A_D8: D15.2(K) P4.8
B_D1: D17.2(K) P7.1
B_D2: D19.2(K) P7.2
B_D3: D21.2(K) P7.3
B_D4: D23.2(K) P7.4
B_D5: D25.2(K) P7.5
B_D6: D26.2(K) P7.6
B_D7: D27.2(K) P7.7
B_D8: D28.2(K) P7.8
NetD1_1: D1.1(A) R13.1
NetD1_2: D1.2(K) P3.4
NetD2_1: D2.1(A) R15.1
NetD3_1: D3.1(A) R16.1
NetD3_2: D3.2(K) P3.3
NetD4_1: D4.1(A) R20.1
NetD4_2: D4.2(K) P3.2
NetD5_1: D5.1(A) R21.1
NetD6_1: D6.1(A) R25.1
NetD7_1: D7.1(A) R26.1
NetD7_2: D7.2(K) P3.1
NetD8_1: D8.1(A) R28.1
NetD9_1: D9.1(A) R29.1
NetD10_1: D10.1(A) R31.1
NetD10_2: D10.2(K) U6.1
NetD11_1: D11.1(A) R32.1
NetD12_1: D12.1(A) R36.1
NetD12_2: D12.2(K) U6.3
NetD13_1: D13.1(A) R38.1
NetD14_1: D14.1(A) R41.1
NetD14_2: D14.2(K) U6.5
NetD15_1: D15.1(A) R42.1
NetD16_1: D16.1(A) R44.1
NetD16_2: D16.2(K) U6.7
NetD17_1: D17.1(A) R45.1
NetD18_1: D18.1(A) R46.1
NetD18_2: D18.2(K) P6.5
NetD19_1: D19.1(A) R49.1
NetD20_1: D20.1(A) R51.1
NetD20_2: D20.2(K) P6.4
NetD21_1: D21.1(A) R54.1
NetD22_1: D22.1(A) R56.1
NetD22_2: D22.2(K) P6.3
NetD23_1: D23.1(A) R59.1
NetD24_1: D24.1(A) R60.1
NetD24_2: D24.2(K) P6.2
NetD25_1: D25.1(A) R61.1
NetD26_1: D26.1(A) R63.1
NetD27_1: D27.1(A) R66.1
NetD28_1: D28.1(A) R68.1
NetP5_1: P5.1 R44.2
NetP5_2: P5.2 R41.2
NetP5_3: P5.3 R36.2
NetP5_4: P5.4 R31.2
NetR13_2: R13.2 U3.2
NetR14_1: R14.1 U3.16 ; port C1
NetR15_2: R15.2 U4.2
NetR16_2: R16.2 U3.4
NetR17_1: R17.1 U3.14 ; port C2
NetR18_1: R18.1 U4.16 ; port A8
NetR19_1: R19.1 U3.12 ; port C3
NetR20_2: R20.2 U3.6
NetR21_2: R21.2 U4.4
NetR22_1: R22.1 U4.14 ; port A7
NetR23_1: R23.1 U3.10 ; port C4
NetR24_1: R24.1 U4.12 ; port A6
NetR25_2: R25.2 U4.6
NetR26_2: R26.2 U3.8
NetR27_1: R27.1 U4.10 ; port A5
NetR28_2: R28.2 U4.8
NetR29_2: R29.2 U5.2
NetR30_1: R30.1 U5.16 ; port A4
NetR32_2: R32.2 U5.4
NetR33_1: R33.1 U6.16 ; port D1
NetR34_1: R34.1 U5.14 ; port A3
NetR35_1: R35.1 U5.12 ; port A2
NetR37_1: R37.1 U6.14 ; port D2
NetR38_2: R38.2 U5.6
NetR39_1: R39.1 U6.12 ; port D3
NetR40_1: R40.1 U5.10 ; port A1
NetR42_2: R42.2 U5.8
NetR43_1: R43.1 U6.10 ; port D4
NetR45_2: R45.2 U7.2
NetR46_2: R46.2 U8.2
NetR47_1: R47.1 U7.16 ; port B1
NetR48_1: R48.1 U8.16 ; port E1
NetR49_2: R49.2 U7.4
NetR50_1: R50.1 U7.14 ; port B2
NetR51_2: R51.2 U8.4
NetR52_1: R52.1 U8.14 ; port E2
NetR53_1: R53.1 U7.12 ; port B3
NetR54_2: R54.2 U7.6
NetR55_1: R55.1 U8.12 ; port E3
NetR56_2: R56.2 U8.6
NetR57_1: R57.1 U7.10 ; port B4
NetR58_1: R58.1 U8.10 ; port E4
NetR59_2: R59.2 U7.8
NetR60_2: R60.2 U8.8
NetR61_2: R61.2 U9.2
NetR62_1: R62.1 U9.16 ; port B5
NetR63_2: R63.2 U9.4
NetR64_1: R64.1 U9.14 ; port B6
NetR65_1: R65.1 U9.12 ; port B7
NetR66_2: R66.2 U9.6
NetR67_1: R67.1 U9.10 ; port B8
NetR68_2: R68.2 U9.8

### Notes on the sheet
- (near U3) 手动
- 超声波*16
- 保护端子
- (near U8) 安全触边
- 编码器隔离变送

### Library data of the parts
D1-D28 = LED3: Typical BLUE SiC LED; Published: 8-Jun-2000; LatestRevisionDate: 17-Dec-2003; LatestRevisionNote: PCB Footprint replaced.; DatasheetVersion: 16-Apr-2002; PackageVersion: 16-Apr-2002; PackageReference: 3.5X2.8X1.9; Publisher: Altium Limited
P3 P5 = Header 4: Header, 4-Pin; LatestRevisionDate: 17-Jul-2002; LatestRevisionNote: Re-released for DXP Platform.; Publisher: Altium Limited
P4 P7 = Header 5X2: Header, 5-Pin, Dual row; LatestRevisionDate: 17-Jul-2002; LatestRevisionNote: Re-released for DXP Platform.; Publisher: Altium Limited
P6 = Header 5: Header, 5-Pin; LatestRevisionDate: 17-Jul-2002; LatestRevisionNote: Re-released for DXP Platform.; Publisher: Altium Limited
R13-R68 = Res3: Resistor; Published: 8-Jun-2000; LatestRevisionDate: 29-May-2009; LatestRevisionNote: IPC-7351 Footprint Added.; PackageReference: J1-0603; Publisher: Altium Limited; PackageDescription: Chip Resistor

## Sheet RELAY_Ctrl.SchDoc
size 254 x 508 mm
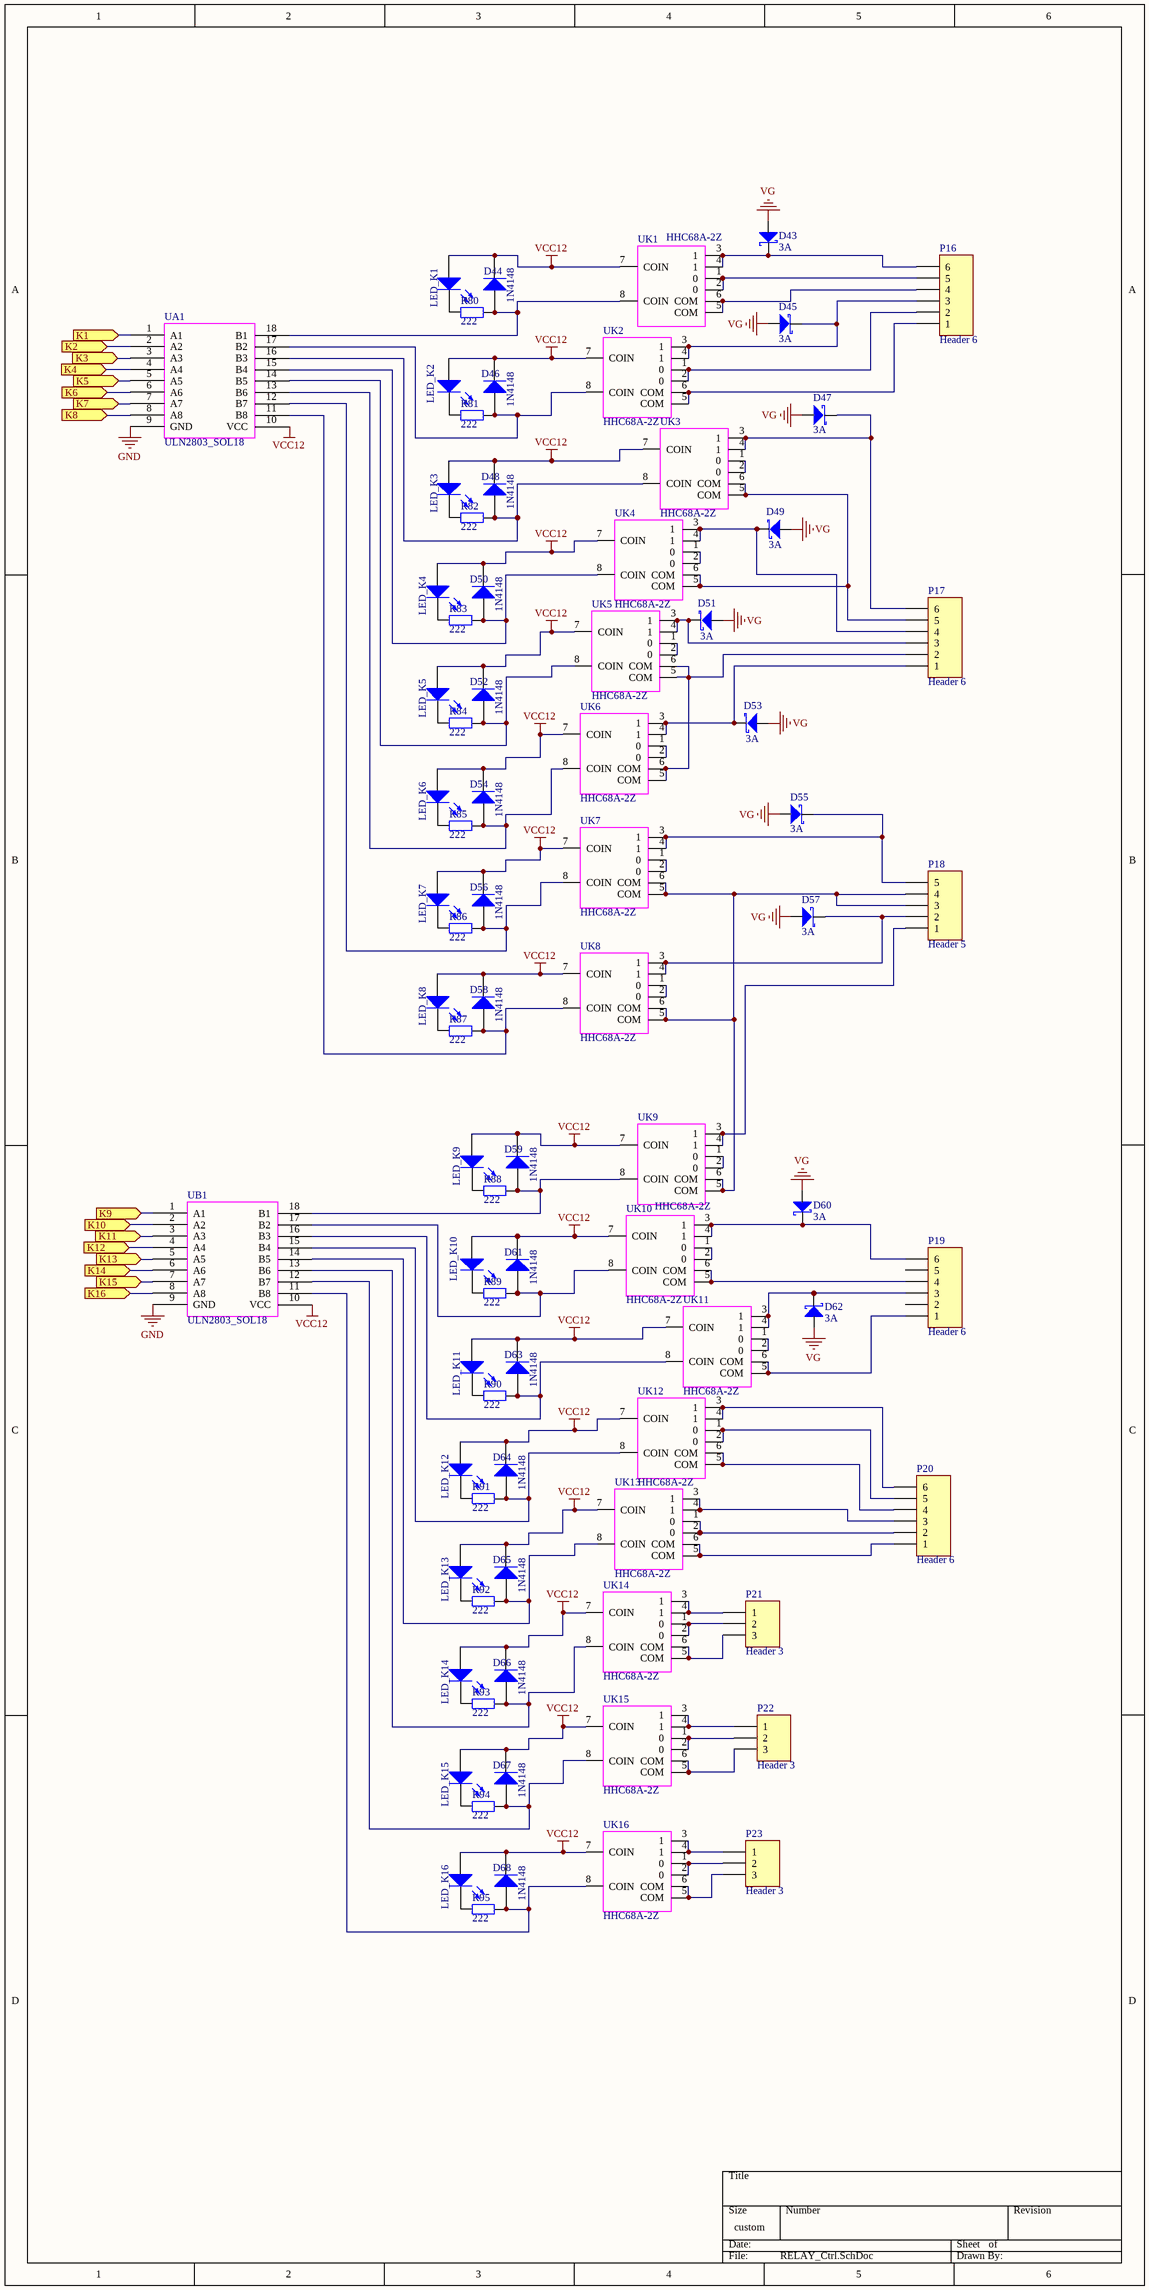
[diagram p4: RELAY_Ctrl.SchDoc]

### Parts
D43  DIO Current: 3A  [SMC]  (hidden comment: DiodeSchottky)
D44  1N4148  [D1206]
D45  DIO Current: 3A  [SMC]  (hidden comment: DiodeSchottky)
D46  1N4148  [D1206]
D47  DIO Current: 3A  [SMC]  (hidden comment: DiodeSchottky)
D48  1N4148  [D1206]
D49  DIO Current: 3A  [SMC]  (hidden comment: DiodeSchottky)
D50  1N4148  [D1206]
D51  DIO Current: 3A  [SMC]  (hidden comment: DiodeSchottky)
D52  1N4148  [D1206]
D53  DIO Current: 3A  [SMC]  (hidden comment: DiodeSchottky)
D54  1N4148  [D1206]
D55  DIO Current: 3A  [SMC]  (hidden comment: DiodeSchottky)
D56  1N4148  [D1206]
D57  DIO Current: 3A  [SMC]  (hidden comment: DiodeSchottky)
D58  1N4148  [D1206]
D59  1N4148  [D1206]
D60  DIO Current: 3A  [SMC]  (hidden comment: DiodeSchottky)
D61  1N4148  [D1206]
D62  DIO Current: 3A  [SMC]  (hidden comment: DiodeSchottky)
D63  1N4148  [D1206]
D64  1N4148  [D1206]
D65  1N4148  [D1206]
D66  1N4148  [D1206]
D67  1N4148  [D1206]
D68  1N4148  [D1206]
LED_K1  (no value)  [1206]
LED_K2  (no value)  [1206]
LED_K3  (no value)  [1206]
LED_K4  (no value)  [1206]
LED_K5  (no value)  [1206]
LED_K6  (no value)  [1206]
LED_K7  (no value)  [1206]
LED_K8  (no value)  [1206]
LED_K9  (no value)  [1206]
LED_K10  (no value)  [1206]
LED_K11  (no value)  [1206]
LED_K12  (no value)  [1206]
LED_K13  (no value)  [1206]
LED_K14  (no value)  [1206]
LED_K15  (no value)  [1206]
LED_K16  (no value)  [1206]
P16  Header 6  [5.08-6P-HT508V]
P17  Header 6  [5.08-6P-HT508V]
P18  Header 5  [5.08-5P-HT508V]
P19  Header 6  [5.08-6P-HT508V]
P20  Header 6  [5.08-6P-HT508V]
P21  Header 3  [5.08-3P-HT508V]
P22  Header 3  [5.08-3P-HT508V]
P23  Header 3  [5.08-3P-HT508V]
R80  value 222  [1206]  (hidden comment: Res2)
R81  value 222  [1206]  (hidden comment: Res2)
R82  value 222  [1206]  (hidden comment: Res2)
R83  value 222  [1206]  (hidden comment: Res2)
R84  value 222  [1206]  (hidden comment: Res2)
R85  value 222  [1206]  (hidden comment: Res2)
R86  value 222  [1206]  (hidden comment: Res2)
R87  value 222  [1206]  (hidden comment: Res2)
R88  value 222  [1206]  (hidden comment: Res2)
R89  value 222  [1206]  (hidden comment: Res2)
R90  value 222  [1206]  (hidden comment: Res2)
R91  value 222  [1206]  (hidden comment: Res2)
R92  value 222  [1206]  (hidden comment: Res2)
R93  value 222  [1206]  (hidden comment: Res2)
R94  value 222  [1206]  (hidden comment: Res2)
R95  value 222  [1206]  (hidden comment: Res2)
UA1  ULN2803_SOL18  [ULN2803_SOL18]
UB1  ULN2803_SOL18  [ULN2803_SOL18]
UK1  HHC68A-2Z  [HHC68A-2Z]
UK2  HHC68A-2Z  [HHC68A-2Z]
UK3  HHC68A-2Z  [HHC68A-2Z]
UK4  HHC68A-2Z  [HHC68A-2Z]
UK5  HHC68A-2Z  [HHC68A-2Z]
UK6  HHC68A-2Z  [HHC68A-2Z]
UK7  HHC68A-2Z  [HHC68A-2Z]
UK8  HHC68A-2Z  [HHC68A-2Z]
UK9  HHC68A-2Z  [HHC68A-2Z]
UK10  HHC68A-2Z  [HHC68A-2Z]
UK11  HHC68A-2Z  [HHC68A-2Z]
UK12  HHC68A-2Z  [HHC68A-2Z]
UK13  HHC68A-2Z  [HHC68A-2Z]
UK14  HHC68A-2Z  [HHC68A-2Z]
UK15  HHC68A-2Z  [HHC68A-2Z]
UK16  HHC68A-2Z  [HHC68A-2Z]

### Ports
K1 (in), K2 (in), K3 (in), K4 (in), K5 (in), K6 (in), K7 (in), K8 (in), K9 (in), K10 (in), K11 (in), K12 (in), K13 (in), K14 (in), K15 (in), K16 (in)

### Nets
GND: UA1.9(GND) UB1.9(GND)
VCC12: D44.2(K) D46.2(K) D48.2(K) D50.2(K) D52.2(K) D54.2(K) D56.2(K) D58.2(K) D59.2(K) D61.2(K) D63.2(K) D64.2(K) D65.2(K) D66.2(K) D67.2(K) D68.2(K) LED_K1.1(A) LED_K2.1(A) LED_K3.1(A) LED_K4.1(A) LED_K5.1(A) LED_K6.1(A) LED_K7.1(A) LED_K8.1(A) LED_K9.1(A) LED_K10.1(A) LED_K11.1(A) LED_K12.1(A) LED_K13.1(A) LED_K14.1(A) LED_K15.1(A) LED_K16.1(A) UA1.10(VCC) UB1.10(VCC) UK1.7(COIN) UK2.7(COIN) UK3.7(COIN) UK4.7(COIN) UK5.7(COIN) UK6.7(COIN) UK7.7(COIN) UK8.7(COIN) UK9.7(COIN) UK10.7(COIN) UK11.7(COIN) UK12.7(COIN) UK13.7(COIN) UK14.7(COIN) UK15.7(COIN) UK16.7(COIN)
VG: D43.1 D45.1 D47.1 D49.1 D51.1 D53.1 D55.1 D57.1 D60.1 D62.1
NetD43_2: D43.2 P16.6 UK1.3(1) UK1.4(1)
NetD44_1: D44.1(A) R80.1 UA1.18(B1) UK1.8(COIN)
NetD45_2: D45.2 P16.3 UK2.3(1) UK2.4(1)
NetD46_1: D46.1(A) R81.1 UA1.17(B2) UK2.8(COIN)
NetD47_2: D47.2 P17.6 UK3.3(1) UK3.4(1)
NetD48_1: D48.1(A) R82.1 UA1.16(B3) UK3.8(COIN)
NetD49_2: D49.2 P17.4 UK4.3(1) UK4.4(1)
NetD50_1: D50.1(A) R83.1 UA1.15(B4) UK4.8(COIN)
NetD51_2: D51.2 P17.3 UK5.3(1) UK5.4(1)
NetD52_1: D52.1(A) R84.1 UA1.14(B5) UK5.8(COIN)
NetD53_2: D53.2 P17.1 UK6.3(1) UK6.4(1)
NetD54_1: D54.1(A) R85.1 UA1.13(B6) UK6.8(COIN)
NetD55_2: D55.2 P18.5 UK7.3(1) UK7.4(1)
NetD56_1: D56.1(A) R86.1 UA1.12(B7) UK7.8(COIN)
NetD57_2: D57.2 P18.2 UK8.3(1) UK8.4(1)
NetD58_1: D58.1(A) R87.1 UA1.11(B8) UK8.8(COIN)
NetD59_1: D59.1(A) R88.1 UB1.18(B1) UK9.8(COIN)
NetD60_2: D60.2 P19.6 UK10.3(1) UK10.4(1)
NetD61_1: D61.1(A) R89.1 UB1.17(B2) UK10.8(COIN)
NetD62_2: D62.2 P19.3 UK11.3(1) UK11.4(1)
NetD63_1: D63.1(A) R90.1 UB1.16(B3) UK11.8(COIN)
NetD64_1: D64.1(A) R91.1 UB1.15(B4) UK12.8(COIN)
NetD65_1: D65.1(A) R92.1 UB1.14(B5) UK13.8(COIN)
NetD66_1: D66.1(A) R93.1 UB1.13(B6) UK14.8(COIN)
NetD67_1: D67.1(A) R94.1 UB1.12(B7) UK15.8(COIN)
NetD68_1: D68.1(A) R95.1 UB1.11(B8) UK16.8(COIN)
NetLED_K1_2: LED_K1.2(K) R80.2
NetLED_K2_2: LED_K2.2(K) R81.2
NetLED_K3_2: LED_K3.2(K) R82.2
NetLED_K4_2: LED_K4.2(K) R83.2
NetLED_K5_2: LED_K5.2(K) R84.2
NetLED_K6_2: LED_K6.2(K) R85.2
NetLED_K7_2: LED_K7.2(K) R86.2
NetLED_K8_2: LED_K8.2(K) R87.2
NetLED_K9_2: LED_K9.2(K) R88.2
NetLED_K10_2: LED_K10.2(K) R89.2
NetLED_K11_2: LED_K11.2(K) R90.2
NetLED_K12_2: LED_K12.2(K) R91.2
NetLED_K13_2: LED_K13.2(K) R92.2
NetLED_K14_2: LED_K14.2(K) R93.2
NetLED_K15_2: LED_K15.2(K) R94.2
NetLED_K16_2: LED_K16.2(K) R95.2
NetP16_1: P16.1 UK2.5(COM) UK2.6(COM)
NetP16_2: P16.2 UK2.1(0) UK2.2(0)
NetP16_4: P16.4 UK1.5(COM) UK1.6(COM)
NetP16_5: P16.5 UK1.1(0) UK1.2(0)
NetP17_2: P17.2 UK5.5(COM) UK5.6(COM) UK6.5(COM) UK6.6(COM)
NetP17_5: P17.5 UK3.5(COM) UK3.6(COM) UK4.5(COM) UK4.6(COM)
NetP18_1: P18.1 UK9.3(1) UK9.4(1)
NetP18_3: P18.3 P18.4 UK7.5(COM) UK7.6(COM) UK8.5(COM) UK8.6(COM) UK9.5(COM) UK9.6(COM)
NetP19_1: P19.1 UK11.5(COM) UK11.6(COM)
NetP19_4: P19.4 UK10.5(COM) UK10.6(COM)
NetP20_1: P20.1 UK13.5(COM) UK13.6(COM)
NetP20_2: P20.2 UK13.1(0) UK13.2(0)
NetP20_3: P20.3 UK13.3(1) UK13.4(1)
NetP20_4: P20.4 UK12.5(COM) UK12.6(COM)
NetP20_5: P20.5 UK12.1(0) UK12.2(0)
NetP20_6: P20.6 UK12.3(1) UK12.4(1)
NetP21_1: P21.1 UK14.3(1) UK14.4(1)
NetP21_2: P21.2 UK14.1(0) UK14.2(0)
NetP21_3: P21.3 UK14.5(COM) UK14.6(COM)
NetP22_1: P22.1 UK15.3(1) UK15.4(1)
NetP22_2: P22.2 UK15.1(0) UK15.2(0)
NetP22_3: P22.3 UK15.5(COM) UK15.6(COM)
NetP23_1: P23.1 UK16.3(1) UK16.4(1)
NetP23_2: P23.2 UK16.1(0) UK16.2(0)
NetP23_3: P23.3 UK16.5(COM) UK16.6(COM)
NetU16_49: UB1.8(A8) ; port K16
NetU16_50: UB1.7(A7) ; port K15
NetU16_53: UB1.6(A6) ; port K14
NetU16_54: UB1.5(A5) ; port K13
NetU16_55: UB1.4(A4) ; port K12
NetU16_56: UB1.3(A3) ; port K11
NetU16_57: UB1.2(A2) ; port K10
NetU16_58: UB1.1(A1) ; port K9
NetU16_59: UA1.8(A8) ; port K8
NetU16_60: UA1.7(A7) ; port K7
NetU16_63: UA1.6(A6) ; port K6
NetU16_64: UA1.5(A5) ; port K5
NetU16_65: UA1.4(A4) ; port K4
NetU16_66: UA1.3(A3) ; port K3
NetU16_67: UA1.2(A2) ; port K2
NetU16_68: UA1.1(A1) ; port K1
NetUK3_1: UK3.1(0) UK3.2(0)
NetUK4_1: UK4.1(0) UK4.2(0)
NetUK5_1: UK5.1(0) UK5.2(0)
NetUK6_1: UK6.1(0) UK6.2(0)
NetUK7_1: UK7.1(0) UK7.2(0)
NetUK8_1: UK8.1(0) UK8.2(0)
NetUK9_1: UK9.1(0) UK9.2(0)
NetUK10_1: UK10.1(0) UK10.2(0)
NetUK11_1: UK11.1(0) UK11.2(0)

Not connected (* = marked no-connect by the designer): P19 2 5

### Library data of the parts
D43 D45 D47 D49 D51 D53 D55 D57 D60 D62 = DiodeSchottky: Godzilla; GeneracPartNumber: Temp0036; Manufacturer: MCC; Manufacturer Part Number: SS110-L; Drawing: S-297K; Substitutes Allowed: No; Operating Max Temp: 150; Operating Min Temp: -55; Circuit ID: ID; Engineering Notes: Notes; DIO Vreverse: 1000; RoHS Compliance: Yes; Mounting: Surface Mount; Package: SMA; DIO Type: Schottky; JEDEC: SS110-L
D44 D46 D48 D50 D52 D54 D56 D58 D59 D61 D63-D68 = Diode 1N4148: High Conductance Fast Diode; Published: 8-Jun-2000; LatestRevisionDate: 17-Jul-2002; LatestRevisionNote: Re-released for DXP Platform.; DatasheetVersion: 1997; PackageReference: DO-35; Publisher: Altium Limited; Code_JEDEC: DO-204-AH; ComponentLink1Description: Manufacturer Link; ComponentLink1URL: http://www.fairchildsemi.com/; ComponentLink2Description: Datasheet; ComponentLink2URL: http://www.fairchildsemi.com/ds/1N%2F1N4148.pdf
LED_K1-LED_K16 = LED2: as DS1 on sheet STM32_CPU; Published: 8-Jun-2000; LatestRevisionDate: 17-Jul-2002; LatestRevisionNote: Re-released for DXP Platform.; PackageDocument: Feb-2002; PackageReference: 3.2X1.6X1.1; Publisher: Altium Limited
P16 P17 P19 P20 = Header 6: Header, 6-Pin; LatestRevisionDate: 17-Jul-2002; LatestRevisionNote: Re-released for DXP Platform.; Publisher: Altium Limited
P18 = Header 5: Header, 5-Pin; LatestRevisionDate: 17-Jul-2002; LatestRevisionNote: Re-released for DXP Platform.; Publisher: Altium Limited
P21-P23 = Header 3: Header, 3-Pin; LatestRevisionDate: 17-Jul-2002; LatestRevisionNote: Re-released for DXP Platform.; Publisher: Altium Limited
R80-R95 = Res2: Resistor; Published: 8-Jun-2000; LatestRevisionDate: 17-Jul-2002; LatestRevisionNote: Re-released for DXP Platform.; PackageReference: AXIAL-0.4; Publisher: Altium Limited

## Sheet UART_Ctrl.SchDoc
size A4
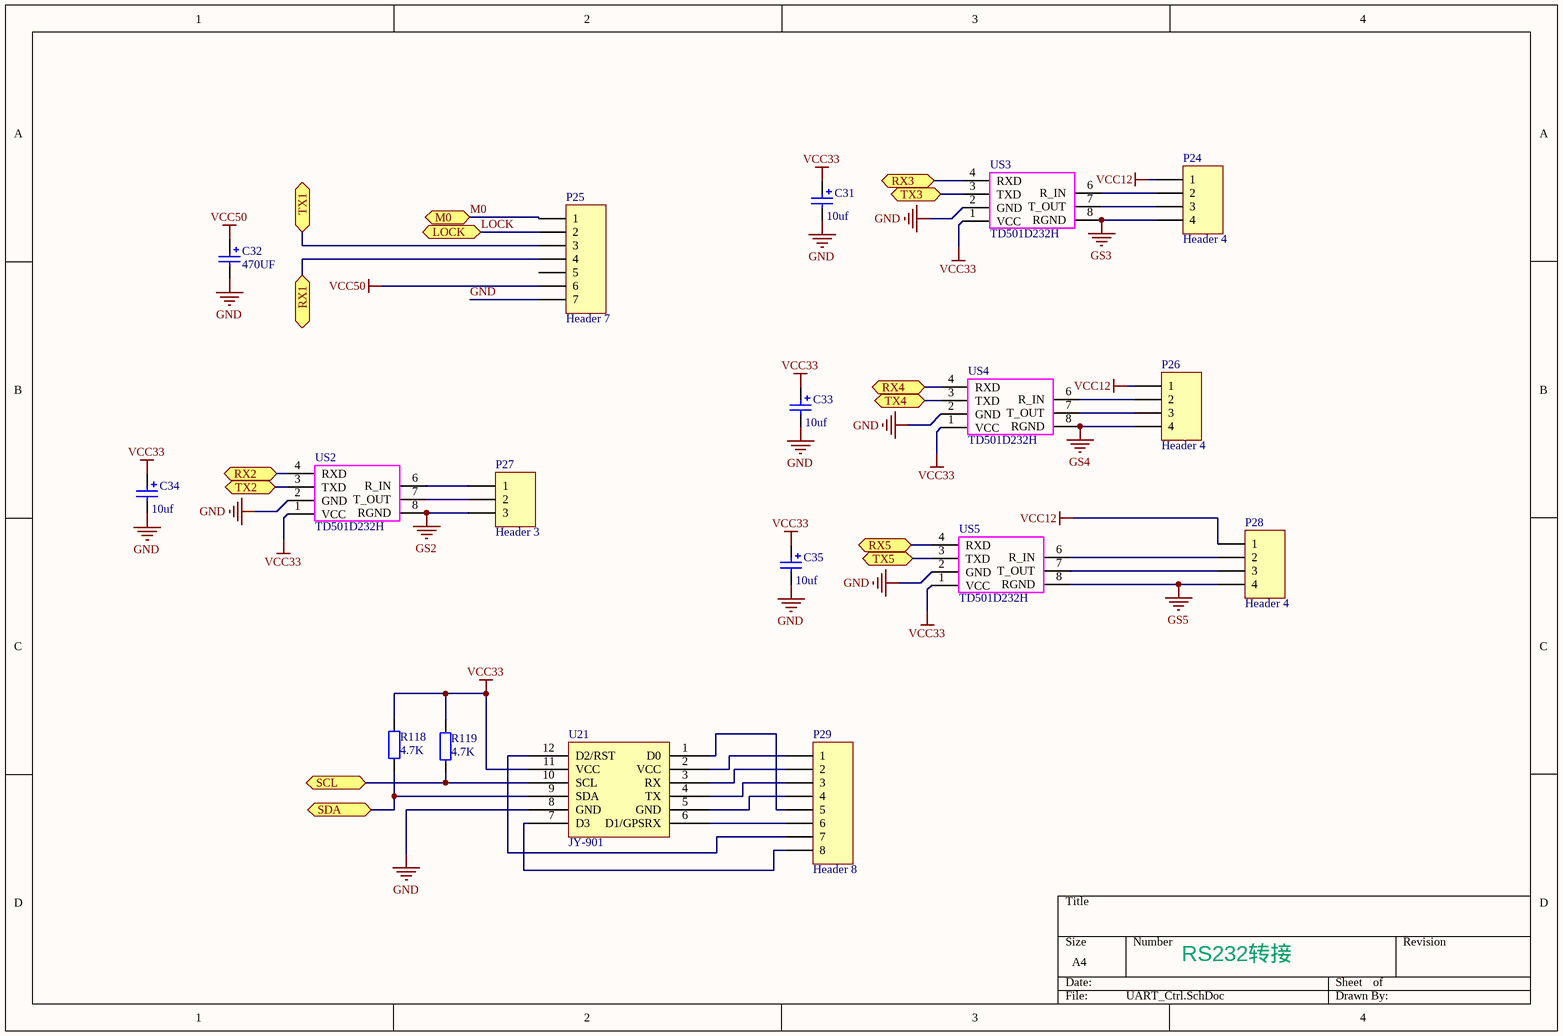
[diagram p5: UART_Ctrl.SchDoc]

### Parts
C31  value 10uf  [C1206]  (hidden comment: Cap Pol2)
C32  value 470UF  [7243-D-TA]  (hidden comment: Cap Pol2)
C33  value 10uf  [C1206]  (hidden comment: Cap Pol2)
C34  value 10uf  [C1206]  (hidden comment: Cap Pol2)
C35  value 10uf  [C1206]  (hidden comment: Cap Pol2)
P24  Header 4  [3.81-4P]
P25  Header 7  [HDR1X7]
P26  Header 4  [3.81-4P]
P27  Header 3  [381-3]
P28  Header 4  [3.81-4P]
P29  Header 8  [HDR1X8]
R118  value 4.7K  [R1206]  (hidden comment: Res2)
R119  value 4.7K  [R1206]  (hidden comment: Res2)
U21  JY-901  [JY-901]
US2  TD501D232H  [TD501D232H]
US3  TD501D232H  [TD501D232H]
US4  TD501D232H  [TD501D232H]
US5  TD501D232H  [TD501D232H]

### Ports
LOCK, M0, RX1, RX2, RX3, RX4, RX5, SCL (bidir), SDA (bidir), TX1, TX2, TX3, TX4, TX5

### Nets
GND: C31.2 C32.2 C33.2 C34.2 C35.2 P25.7 U21.8(GND) US2.2(GND) US3.2(GND) US4.2(GND) US5.2(GND)
GS2: P27.3 US2.8(RGND)
GS3: P24.4 US3.8(RGND)
GS4: P26.4 US4.8(RGND)
GS5: P28.4 US5.8(RGND)
VCC12: P24.1 P26.1 P28.1
VCC33: C31.1 C33.1 C34.1 C35.1 R118.1 R119.1 U21.11(VCC) US2.1(VCC) US3.1(VCC) US4.1(VCC) US5.1(VCC)
VCC50: C32.1 P25.6
LOCK: P25.2 ; port LOCK
M0: P25.1 ; port M0
NetP24_2: P24.2 US3.6(R_IN)
NetP24_3: P24.3 US3.7(T_OUT)
NetP25_3: P25.3 ; port TX1
NetP25_4: P25.4 ; port RX1
NetP26_2: P26.2 US4.6(R_IN)
NetP26_3: P26.3 US4.7(T_OUT)
NetP27_1: P27.1 US2.6(R_IN)
NetP27_2: P27.2 US2.7(T_OUT)
NetP28_2: P28.2 US5.6(R_IN)
NetP28_3: P28.3 US5.7(T_OUT)
NetP29_1: P29.1 U21.2(VCC)
NetP29_2: P29.2 U21.3(RX)
NetP29_3: P29.3 U21.4(TX)
NetP29_4: P29.4 U21.5(GND)
NetP29_5: P29.5 U21.1(D0)
NetP29_6: P29.6 U21.6(D1/GPSRX)
NetP29_7: P29.7 U21.12(D2/RST)
NetP29_8: P29.8 U21.7(D3)
NetR118_2: R118.2 U21.9(SDA) ; port SDA
NetR119_2: R119.2 U21.10(SCL) ; port SCL
NetU16_36: US2.3(TXD) ; port TX2
NetU16_37: US2.4(RXD) ; port RX2
NetU16_69: US3.3(TXD) ; port TX3
NetU16_70: US3.4(RXD) ; port RX3
NetU16_111: US4.3(TXD) ; port TX4
NetU16_112: US4.4(RXD) ; port RX4
NetU16_113: US5.3(TXD) ; port TX5
NetU16_116: US5.4(RXD) ; port RX5

Not connected (* = marked no-connect by the designer): P25 5

### Notes on the sheet
- RS232转接

### Library data of the parts
C31-C35 = Cap Pol2: Polarized Capacitor (Axial); Published: 8-Jun-2000; LatestRevisionDate: 17-Jul-2002; LatestRevisionNote: Re-released for DXP Platform.; PackageReference: POLAR0.8; Publisher: Altium Limited
P24 P26 P28 = Header 4: Header, 4-Pin; LatestRevisionDate: 17-Jul-2002; LatestRevisionNote: Re-released for DXP Platform.; Publisher: Altium Limited
P25 = Header 7: Header, 7-Pin; LatestRevisionDate: 17-Jul-2002; LatestRevisionNote: Re-released for DXP Platform.; Publisher: Altium Limited
P27 = Header 3: Header, 3-Pin; LatestRevisionDate: 17-Jul-2002; LatestRevisionNote: Re-released for DXP Platform.; Publisher: Altium Limited
P29 = Header 8: Header, 8-Pin; LatestRevisionDate: 17-Jul-2002; LatestRevisionNote: Re-released for DXP Platform.; Publisher: Altium Limited
R118 R119 = Res2: Resistor; Published: 8-Jun-2000; LatestRevisionDate: 17-Jul-2002; LatestRevisionNote: Re-released for DXP Platform.; PackageReference: AXIAL-0.4; Publisher: Altium Limited
U21 = JY-901: 君悦智控高精度9轴传感器

## Sheet POWER_Ctrl.SchDoc
size A4
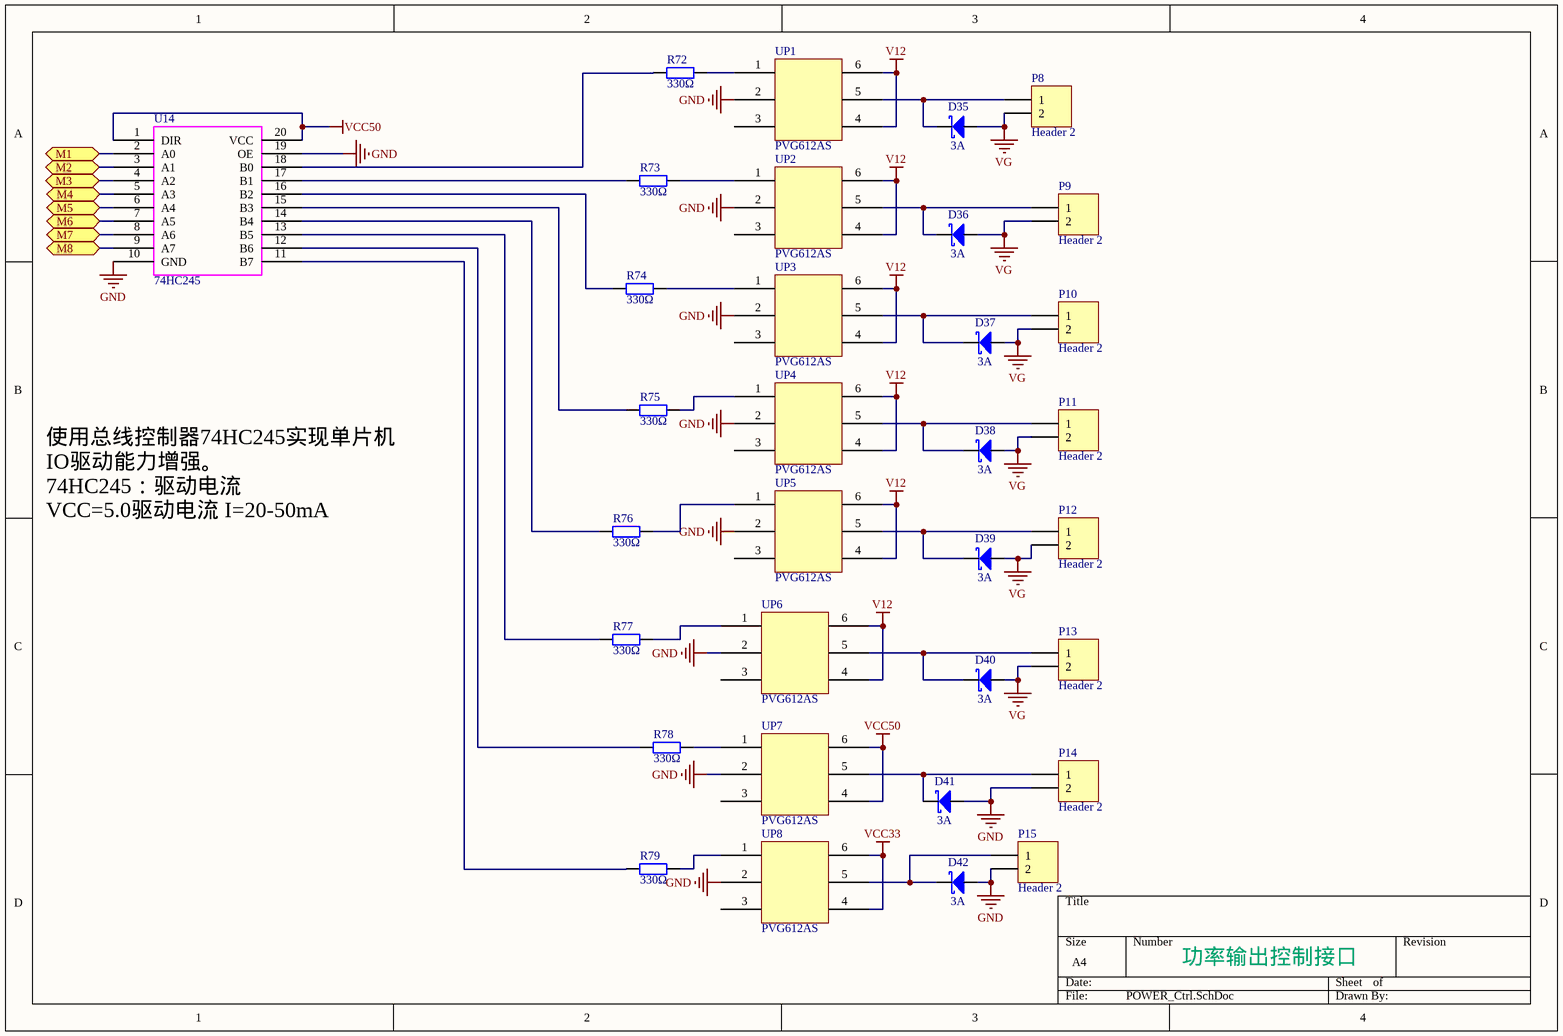
[diagram p6: POWER_Ctrl.SchDoc]

### Parts
D35  DIO Current: 3A  [SMA]  (hidden comment: DiodeSchottky)
D36  DIO Current: 3A  [SMA]  (hidden comment: DiodeSchottky)
D37  DIO Current: 3A  [SMA]  (hidden comment: DiodeSchottky)
D38  DIO Current: 3A  [SMA]  (hidden comment: DiodeSchottky)
D39  DIO Current: 3A  [SMA]  (hidden comment: DiodeSchottky)
D40  DIO Current: 3A  [SMA]  (hidden comment: DiodeSchottky)
D41  DIO Current: 3A  [SMA]  (hidden comment: DiodeSchottky)
D42  DIO Current: 3A  [SMA]  (hidden comment: DiodeSchottky)
P8  Header 2  [3.81-2P]
P9  Header 2  [3.81-2P]
P10  Header 2  [3.81-2P]
P11  Header 2  [3.81-2P]
P12  Header 2  [3.81-2P]
P13  Header 2  [3.81-2P]
P14  Header 2  [3.81-2P]
P15  Header 2  [3.81-2P]
R72  value 330Ω  [1206]  (hidden comment: Res2)
R73  value 330Ω  [1206]  (hidden comment: Res2)
R74  value 330Ω  [1206]  (hidden comment: Res2)
R75  value 330Ω  [1206]  (hidden comment: Res2)
R76  value 330Ω  [1206]  (hidden comment: Res2)
R77  value 330Ω  [1206]  (hidden comment: Res2)
R78  value 330Ω  [1206]  (hidden comment: Res2)
R79  value 330Ω  [1206]  (hidden comment: Res2)
U14  74HC245  [74HC245D]
UP1  PVG612AS  [SMD-6]
UP2  PVG612AS  [SMD-6]
UP3  PVG612AS  [SMD-6]
UP4  PVG612AS  [SMD-6]
UP5  PVG612AS  [SMD-6]
UP6  PVG612AS  [SMD-6]
UP7  PVG612AS  [SMD-6]
UP8  PVG612AS  [SMD-6]

### Ports
M1 (bidir), M2 (bidir), M3 (bidir), M4 (bidir), M5 (bidir), M6 (bidir), M7 (bidir), M8 (bidir)

### Nets
GND: D41.1 D42.1 P14.2 P15.2 U14.10(GND) U14.19(OE) UP1.2 UP2.2 UP3.2 UP4.2 UP5.2 UP6.2 UP7.2 UP8.2
V12: UP1.4 UP1.6 UP2.4 UP2.6 UP3.4 UP3.6 UP4.4 UP4.6 UP5.4 UP5.6 UP6.4 UP6.6
VCC33: UP8.4 UP8.6
VCC50: U14.1(DIR) U14.20(VCC) UP7.4 UP7.6
VG: D35.1 D36.1 D37.1 D38.1 D39.1 D40.1 P8.2 P9.2 P10.2 P11.2 P12.2 P13.2
NetD35_2: D35.2 P8.1 UP1.5
NetD36_2: D36.2 P9.1 UP2.5
NetD37_2: D37.2 P10.1 UP3.5
NetD38_2: D38.2 P11.1 UP4.5
NetD39_2: D39.2 P12.1 UP5.5
NetD40_2: D40.2 P13.1 UP6.5
NetD41_2: D41.2 P14.1 UP7.5
NetD42_2: D42.2 P15.1 UP8.5
NetR72_1: R72.1 UP1.1
NetR72_2: R72.2 U14.18(B0)
NetR73_1: R73.1 UP2.1
NetR73_2: R73.2 U14.17(B1)
NetR74_1: R74.1 UP3.1
NetR74_2: R74.2 U14.16(B2)
NetR75_1: R75.1 UP4.1
NetR75_2: R75.2 U14.15(B3)
NetR76_1: R76.1 UP5.1
NetR76_2: R76.2 U14.14(B4)
NetR77_1: R77.1 UP6.1
NetR77_2: R77.2 U14.13(B5)
NetR78_1: R78.1 UP7.1
NetR78_2: R78.2 U14.12(B6)
NetR79_1: R79.1 UP8.1
NetR79_2: R79.2 U14.11(B7)
NetU14_2: U14.2(A0) ; port M1
NetU14_3: U14.3(A1) ; port M2
NetU14_4: U14.4(A2) ; port M3
NetU14_5: U14.5(A3) ; port M4
NetU14_6: U14.6(A4) ; port M5
NetU14_7: U14.7(A5) ; port M6
NetU14_8: U14.8(A6) ; port M7
NetU14_9: U14.9(A7) ; port M8

Not connected (* = marked no-connect by the designer): UP1 3; UP2 3; UP3 3; UP4 3; UP5 3; UP6 3; UP7 3; UP8 3

### Notes on the sheet
- 使用总线控制器74HC245实现单片机IO驱动能力增强。
  74HC245：驱动电流
  VCC=5.0驱动电流 I=20-50mA
- 功率输出控制接口

### Library data of the parts
D35-D42 = DiodeSchottky: as D43 on sheet RELAY_Ctrl; RoHS Compliance: Yes; Mounting: Surface Mount; Package: SMA; DIO Type: Schottky; JEDEC: SS110-L
P8-P15 = Header 2: Header, 2-Pin; LatestRevisionDate: 17-Jul-2002; LatestRevisionNote: Re-released for DXP Platform.; Publisher: Altium Limited
R72-R79 = Res2: Resistor; Published: 8-Jun-2000; LatestRevisionDate: 17-Jul-2002; LatestRevisionNote: Re-released for DXP Platform.; PackageReference: AXIAL-0.4; Publisher: Altium Limited

## Sheet ADC.SchDoc
size A4
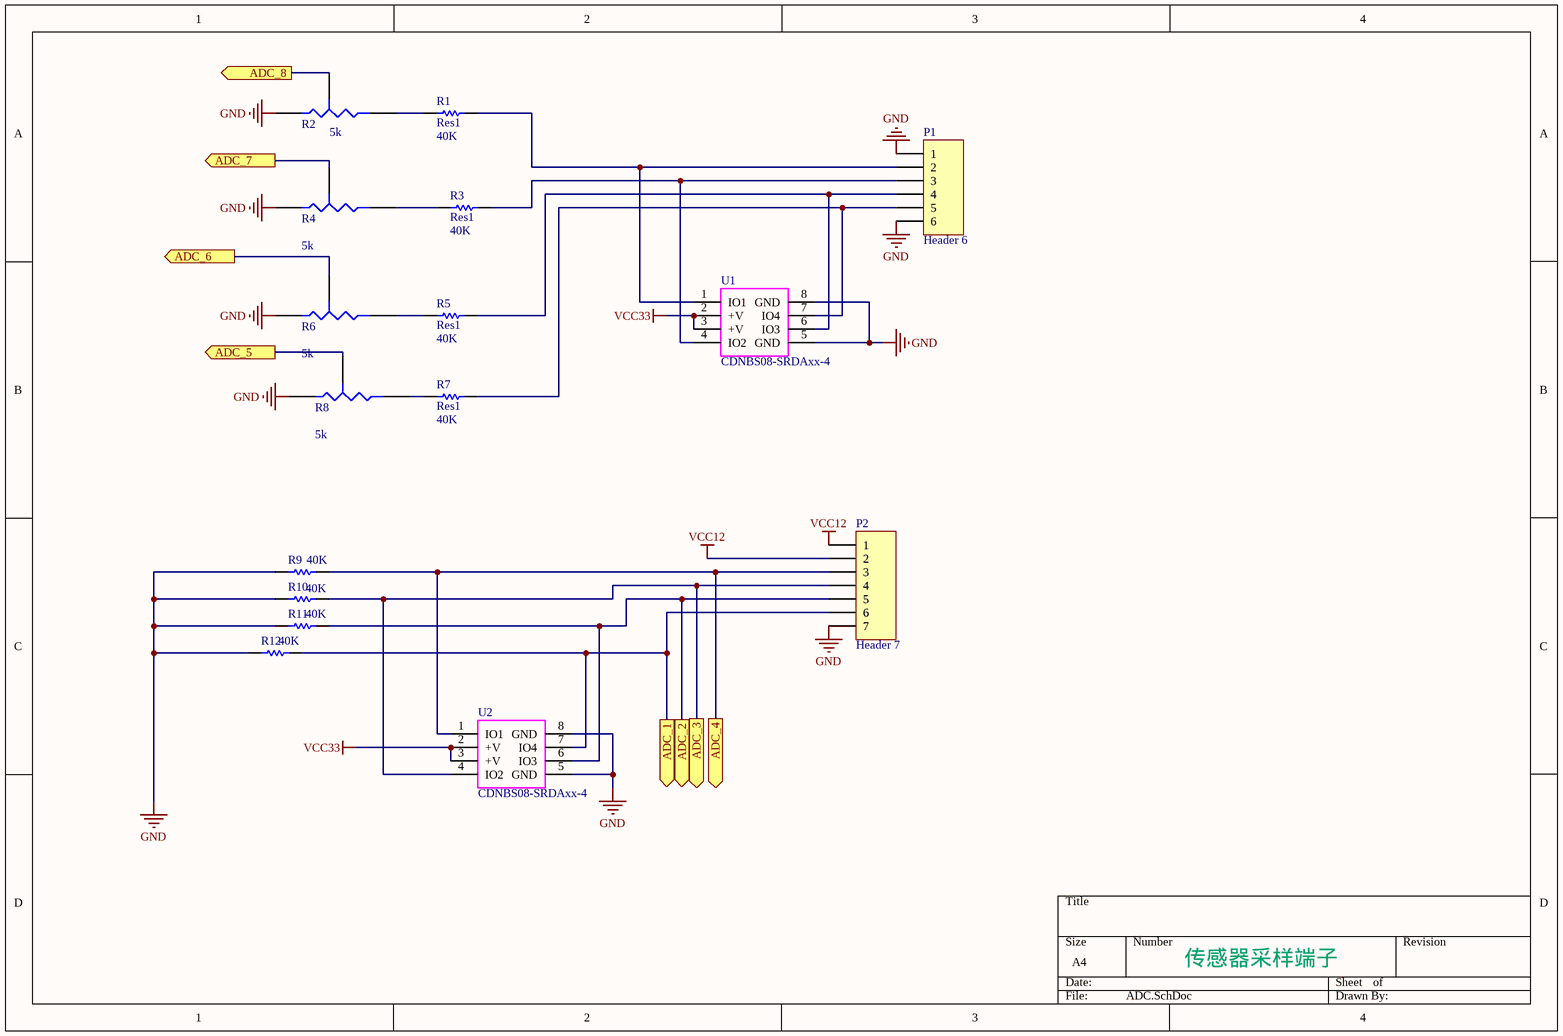
[diagram p7: ADC.SchDoc]

### Parts
P1  Header 6  [3.81-6P]
P2  Header 7  [3.81-7P]
R1  Res1  value 40K  [AXIAL-0.1]
R2  value 5k  [RES-RV3296W]  (hidden comment: Res Tap)
R3  Res1  value 40K  [AXIAL-0.1]
R4  value 5k  [RES-RV3296W]  (hidden comment: Res Tap)
R5  Res1  value 40K  [AXIAL-0.1]
R6  value 5k  [RES-RV3296W]  (hidden comment: Res Tap)
R7  Res1  value 40K  [AXIAL-0.1]
R8  value 5k  [RES-RV3296W]  (hidden comment: Res Tap)
R9  value 40K  [AXIAL-0.2]  (hidden comment: Res1)
R10  value 40K  [AXIAL-0.2]  (hidden comment: Res1)
R11  value 40K  [AXIAL-0.2]  (hidden comment: Res1)
R12  value 40K  [AXIAL-0.2]  (hidden comment: Res1)
U1  CDNBS08-SRDAxx-4  [CDNBS08-SRDAxx-4]
U2  CDNBS08-SRDAxx-4  [CDNBS08-SRDAxx-4]

### Ports
ADC_1 (out), ADC_2 (out), ADC_3 (out), ADC_4 (out), ADC_5 (out), ADC_6 (out), ADC_7 (out), ADC_8 (out)

### Nets
GND: P1.1 P1.6 P2.7 R2.1(A) R4.1(A) R6.1(A) R8.1(A) R9.1 R10.1 R11.1 R12.1 U1.5(GND) U1.8(GND) U2.5(GND) U2.8(GND)
VCC12: P2.1 P2.2
VCC33: U1.2(+V) U1.3(+V) U2.2(+V) U2.3(+V)
NetP1_2: P1.2 R1.2 U1.1(IO1)
NetP1_3: P1.3 R3.2 U1.4(IO2)
NetP1_4: P1.4 R5.2 U1.6(IO3)
NetP1_5: P1.5 R7.2 U1.7(IO4)
NetP2_3: P2.3 R9.2 U2.1(IO1) ; port ADC_4
NetP2_4: P2.4 R10.2 U2.4(IO2) ; port ADC_3
NetP2_5: P2.5 R11.2 U2.6(IO3) ; port ADC_2
NetP2_6: P2.6 R12.2 U2.7(IO4) ; port ADC_1
NetR1_1: R1.1 R2.2(B)
NetR2_3: R2.3(TAP) ; port ADC_8
NetR3_1: R3.1 R4.2(B)
NetR4_3: R4.3(TAP) ; port ADC_7
NetR5_1: R5.1 R6.2(B)
NetR6_3: R6.3(TAP) ; port ADC_6
NetR7_1: R7.1 R8.2(B)
NetR8_3: R8.3(TAP) ; port ADC_5

### Notes on the sheet
- 传感器采样端子

### Library data of the parts
P1 = Header 6: Header, 6-Pin; LatestRevisionDate: 17-Jul-2002; LatestRevisionNote: Re-released for DXP Platform.; Publisher: Altium Limited
P2 = Header 7: Header, 7-Pin; LatestRevisionDate: 17-Jul-2002; LatestRevisionNote: Re-released for DXP Platform.; Publisher: Altium Limited
R1 R3 R5 R7 R9-R12 = Res1: Resistor; Published: 8-Jun-2000; LatestRevisionDate: 17-Jul-2002; LatestRevisionNote: Re-released for DXP Platform.; PackageReference: AXIAL-0.3; Publisher: Altium Limited
R2 R4 R6 R8 = Res Tap: Tapped Resistor; Sim Note: Enter the Resistance value and the set point into parameter fields.; Set Position: 0.5; Published: 24-Mar-1999; LatestRevisionDate: 17-Jul-2002; LatestRevisionNote: Re-released for DXP Platform.; PackageReference: VR3; Publisher: Altium Limited

## Nets that join several sheets
GND: POWER (9 pins), STM32_CPU (44 pins), ENCODER_Ctrl (30 pins), RELAY_Ctrl (UA1.9 UB1.9), UART_Ctrl (11 pins), POWER_Ctrl (14 pins), ADC (15 pins)
V12: POWER (D31.2), ENCODER_Ctrl (8 pins), POWER_Ctrl (12 pins)
VCC12: POWER (C2.1 U10.3), STM32_CPU (LS1.1), ENCODER_Ctrl (18 pins), RELAY_Ctrl (50 pins), UART_Ctrl (P24.1 P26.1 P28.1), ADC (P2.1 P2.2)
VCC33: POWER (C7.1 U11.6 U13.5), STM32_CPU (44 pins), ENCODER_Ctrl (28 pins), UART_Ctrl (11 pins), POWER_Ctrl (UP8.4 UP8.6), ADC (U1.2 U1.3 U2.2 U2.3)
VCC50: POWER (C12.1 U12.6), STM32_CPU (C14.2 U18.2 U18.3), UART_Ctrl (C32.1 P25.6), POWER_Ctrl (U14.1 U14.20 UP7.4 UP7.6)
VG: POWER (14 pins), ENCODER_Ctrl (5 pins), RELAY_Ctrl (10 pins), POWER_Ctrl (12 pins)
LOCK: STM32_CPU (U16.100), UART_Ctrl (P25.2)
M0: STM32_CPU (U16.110), UART_Ctrl (P25.1)
NetP2_3: STM32_CPU (U16.43), ADC (P2.3 R9.2 U2.1)
NetP2_4: STM32_CPU (U16.42), ADC (P2.4 R10.2 U2.4)
NetP2_5: STM32_CPU (U16.41), ADC (P2.5 R11.2 U2.6)
NetP2_6: STM32_CPU (U16.40), ADC (P2.6 R12.2 U2.7)
NetP25_3: STM32_CPU (U16.101), UART_Ctrl (P25.3)
NetP25_4: STM32_CPU (U16.102), UART_Ctrl (P25.4)
NetR2_3: STM32_CPU (U16.47), ADC (R2.3)
NetR4_3: STM32_CPU (U16.46), ADC (R4.3)
NetR6_3: STM32_CPU (U16.45), ADC (R6.3)
NetR8_3: STM32_CPU (U16.44), ADC (R8.3)
NetR14_1: STM32_CPU (U16.77), ENCODER_Ctrl (R14.1 U3.16)
NetR17_1: STM32_CPU (U16.78), ENCODER_Ctrl (R17.1 U3.14)
NetR18_1: STM32_CPU (U16.87), ENCODER_Ctrl (R18.1 U4.16)
NetR19_1: STM32_CPU (U16.79), ENCODER_Ctrl (R19.1 U3.12)
NetR22_1: STM32_CPU (U16.88), ENCODER_Ctrl (R22.1 U4.14)
NetR23_1: STM32_CPU (U16.80), ENCODER_Ctrl (R23.1 U3.10)
NetR24_1: STM32_CPU (U16.89), ENCODER_Ctrl (R24.1 U4.12)
NetR27_1: STM32_CPU (U16.90), ENCODER_Ctrl (R27.1 U4.10)
NetR30_1: STM32_CPU (U16.91), ENCODER_Ctrl (R30.1 U5.16)
NetR33_1: STM32_CPU (U16.81), ENCODER_Ctrl (R33.1 U6.16)
NetR34_1: STM32_CPU (U16.92), ENCODER_Ctrl (R34.1 U5.14)
NetR35_1: STM32_CPU (U16.93), ENCODER_Ctrl (R35.1 U5.12)
NetR37_1: STM32_CPU (U16.82), ENCODER_Ctrl (R37.1 U6.14)
NetR39_1: STM32_CPU (U16.85), ENCODER_Ctrl (R39.1 U6.12)
NetR40_1: STM32_CPU (U16.96), ENCODER_Ctrl (R40.1 U5.10)
NetR43_1: STM32_CPU (U16.86), ENCODER_Ctrl (R43.1 U6.10)
NetR47_1: STM32_CPU (U16.97), ENCODER_Ctrl (R47.1 U7.16)
NetR48_1: STM32_CPU (U16.73), ENCODER_Ctrl (R48.1 U8.16)
NetR50_1: STM32_CPU (U16.98), ENCODER_Ctrl (R50.1 U7.14)
NetR52_1: STM32_CPU (U16.74), ENCODER_Ctrl (R52.1 U8.14)
NetR53_1: STM32_CPU (U16.99), ENCODER_Ctrl (R53.1 U7.12)
NetR55_1: STM32_CPU (U16.75), ENCODER_Ctrl (R55.1 U8.12)
NetR57_1: STM32_CPU (U16.118), ENCODER_Ctrl (R57.1 U7.10)
NetR58_1: STM32_CPU (U16.76), ENCODER_Ctrl (R58.1 U8.10)
NetR62_1: STM32_CPU (U16.119), ENCODER_Ctrl (R62.1 U9.16)
NetR64_1: STM32_CPU (U16.122), ENCODER_Ctrl (R64.1 U9.14)
NetR65_1: STM32_CPU (U16.123), ENCODER_Ctrl (R65.1 U9.12)
NetR67_1: STM32_CPU (U16.124), ENCODER_Ctrl (R67.1 U9.10)
NetR118_2: STM32_CPU (U16.141), UART_Ctrl (R118.2 U21.9)
NetR119_2: STM32_CPU (U16.142), UART_Ctrl (R119.2 U21.10)
NetU13_1: POWER (U13.1), STM32_CPU (U16.103)
NetU13_3: POWER (U13.3), STM32_CPU (U16.104)
NetU14_2: STM32_CPU (U16.135), POWER_Ctrl (U14.2)
NetU14_3: STM32_CPU (U16.134), POWER_Ctrl (U14.3)
NetU14_4: STM32_CPU (U16.133), POWER_Ctrl (U14.4)
NetU14_5: STM32_CPU (U16.132), POWER_Ctrl (U14.5)
NetU14_6: STM32_CPU (U16.129), POWER_Ctrl (U14.6)
NetU14_7: STM32_CPU (U16.128), POWER_Ctrl (U14.7)
NetU14_8: STM32_CPU (U16.127), POWER_Ctrl (U14.8)
NetU14_9: STM32_CPU (U16.126), POWER_Ctrl (U14.9)
NetU16_36: STM32_CPU (U16.36), UART_Ctrl (US2.3)
NetU16_37: STM32_CPU (U16.37), UART_Ctrl (US2.4)
NetU16_49: STM32_CPU (U16.49), RELAY_Ctrl (UB1.8)
NetU16_50: STM32_CPU (U16.50), RELAY_Ctrl (UB1.7)
NetU16_53: STM32_CPU (U16.53), RELAY_Ctrl (UB1.6)
NetU16_54: STM32_CPU (U16.54), RELAY_Ctrl (UB1.5)
NetU16_55: STM32_CPU (U16.55), RELAY_Ctrl (UB1.4)
NetU16_56: STM32_CPU (U16.56), RELAY_Ctrl (UB1.3)
NetU16_57: STM32_CPU (U16.57), RELAY_Ctrl (UB1.2)
NetU16_58: STM32_CPU (U16.58), RELAY_Ctrl (UB1.1)
NetU16_59: STM32_CPU (U16.59), RELAY_Ctrl (UA1.8)
NetU16_60: STM32_CPU (U16.60), RELAY_Ctrl (UA1.7)
NetU16_63: STM32_CPU (U16.63), RELAY_Ctrl (UA1.6)
NetU16_64: STM32_CPU (U16.64), RELAY_Ctrl (UA1.5)
NetU16_65: STM32_CPU (U16.65), RELAY_Ctrl (UA1.4)
NetU16_66: STM32_CPU (U16.66), RELAY_Ctrl (UA1.3)
NetU16_67: STM32_CPU (U16.67), RELAY_Ctrl (UA1.2)
NetU16_68: STM32_CPU (U16.68), RELAY_Ctrl (UA1.1)
NetU16_69: STM32_CPU (U16.69), UART_Ctrl (US3.3)
NetU16_70: STM32_CPU (U16.70), UART_Ctrl (US3.4)
NetU16_111: STM32_CPU (U16.111), UART_Ctrl (US4.3)
NetU16_112: STM32_CPU (U16.112), UART_Ctrl (US4.4)
NetU16_113: STM32_CPU (U16.113), UART_Ctrl (US5.3)
NetU16_116: STM32_CPU (U16.116), UART_Ctrl (US5.4)